# EAGLE design power electronicsV4.1 (EAGLE 9.6.2)

## Sheet 1 of 3
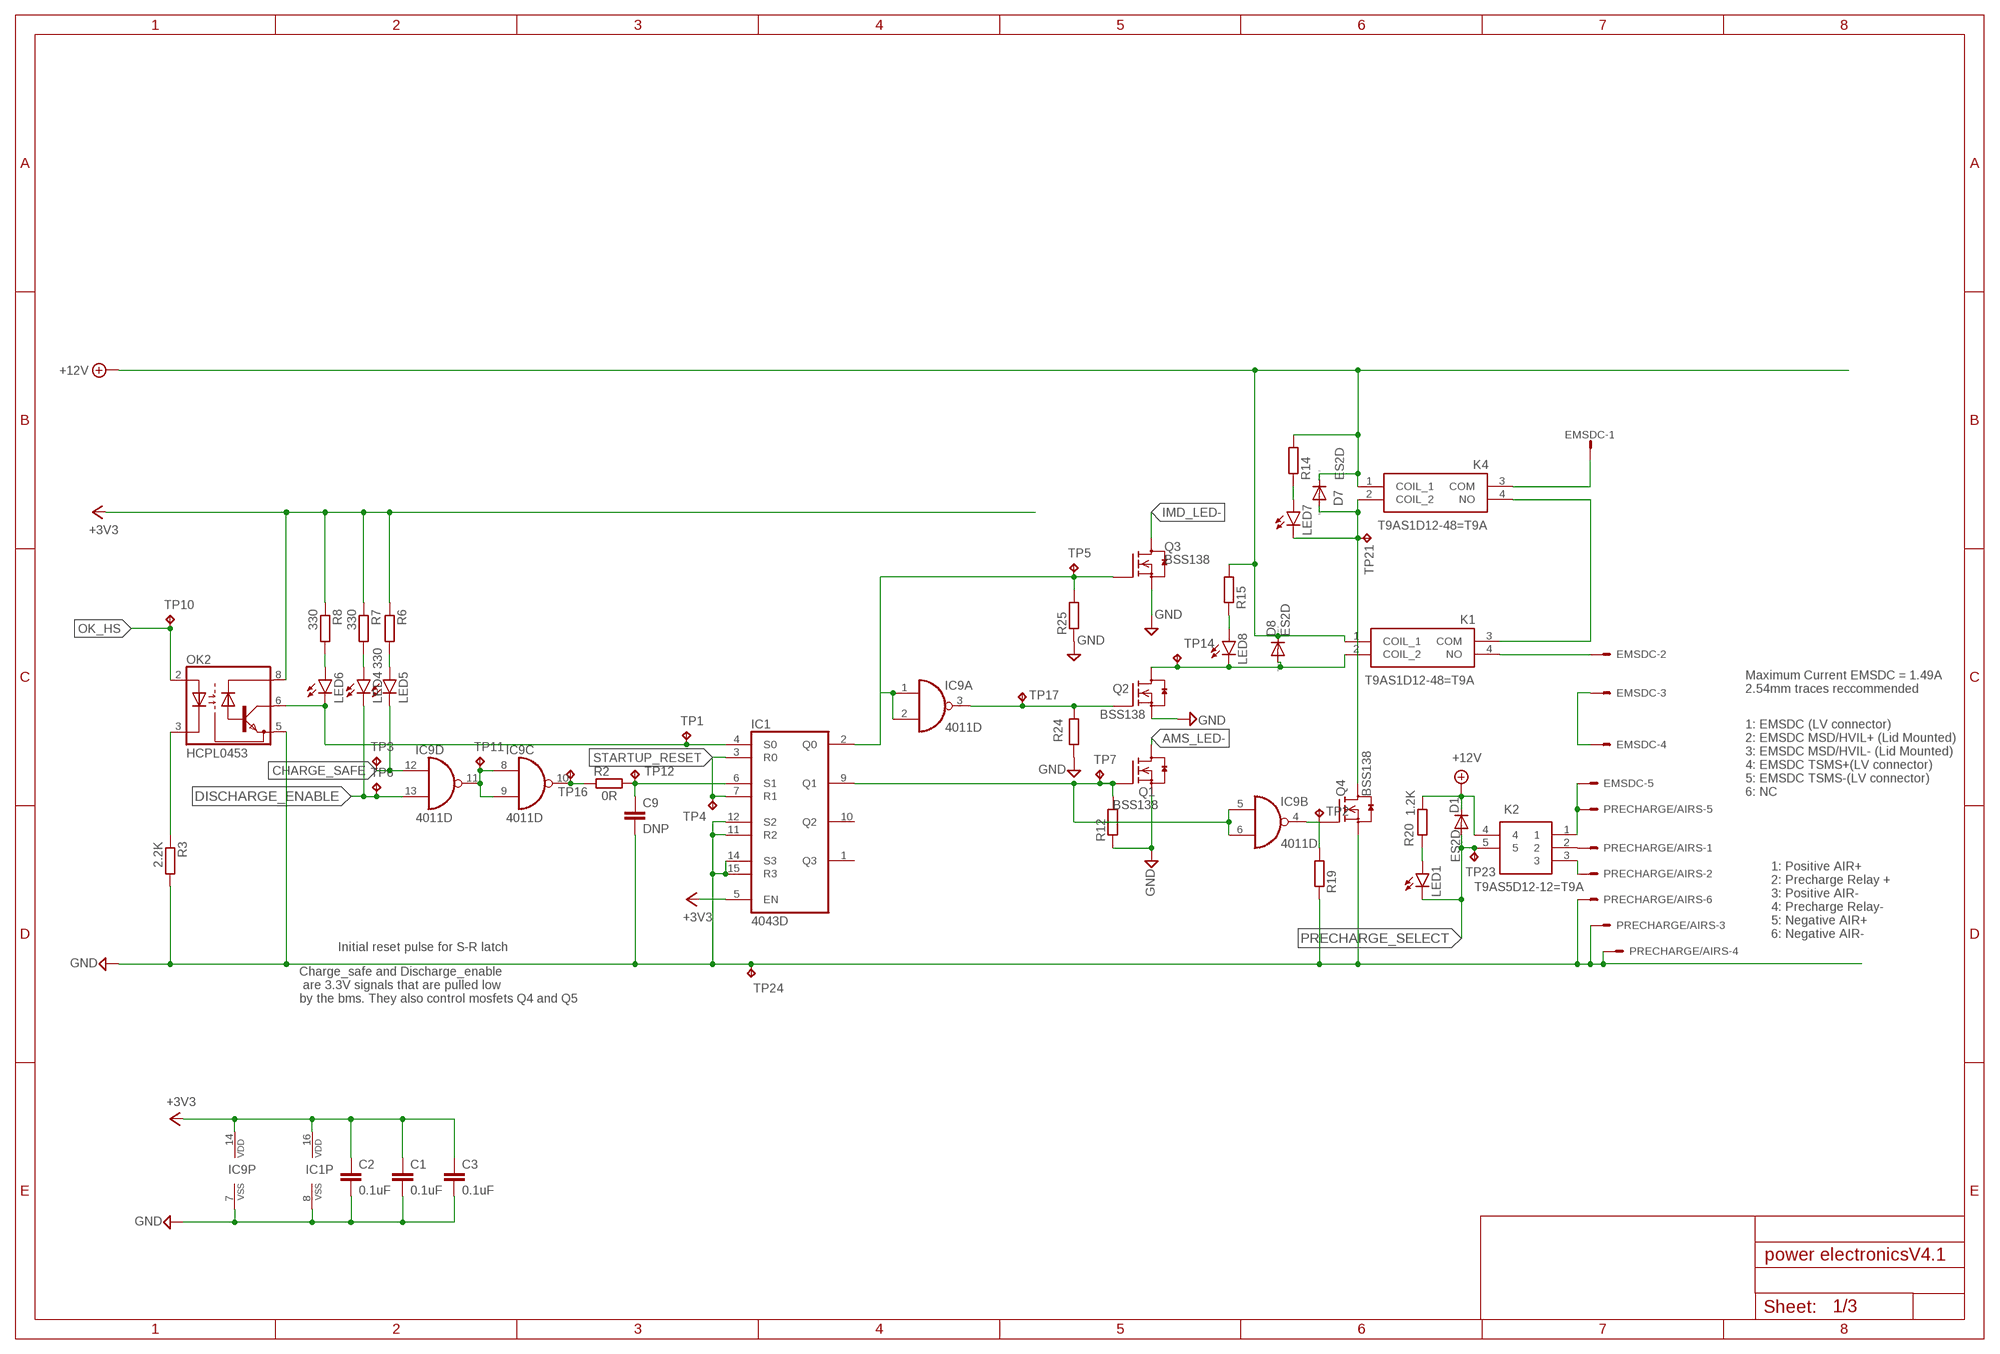
[diagram p0: schematic, sheet 1]

### Parts
C1  0.1uF  C-EUC0805  [C0805]
C2  0.1uF  C-EUC0805  [C0805]
C3  0.1uF  C-EUC0805  [C0805]
C9  DNP  C-EUC0805K  [C0805K]
D1  ES2D  [SMB]
D7  ES2D  [SMB]
D8  ES2D  [SMB]
EMSDC  KK-156-6  [KK-156-6]
IC1  4043D  [SO16]
IC9  4011D  [SO14]
K1  T9AS1D12-48=T9A  [T9AS1D1248T9A]
K2  T9AS5D12-12=T9A  [T9AS1D12]
K4  T9AS1D12-48=T9A  [T9AS1D1248T9A]
LED1  LEDSML0805  [SML0805]
LED4  LEDSML0805  [SML0805]
LED5  LEDSML0805  [SML0805]
LED6  LEDSML0805  [SML0805]
LED7  LEDSML0805  [SML0805]
LED8  LEDSML0805  [SML0805]
OK2  HCPL0453  [SOIC08]
PRECHARGE/AIRS  KK-156-6  [KK-156-6]
Q1  BSS138  [SOT23]
Q2  BSS138  [SOT23]
Q3  BSS138  [SOT23]
Q4  BSS138  [SOT23]
R2  0R  R-EU_R0805  [R0805]
R3  2.2K  R-EU_R0805  [R0805]
R6  330  R-EU_R0805  [R0805]
R7  330  R-EU_R0805  [R0805]
R8  330  R-EU_R0805  [R0805]
R12  R-EU_R0805  [R0805]
R14  R-EU_R0805  [R0805]
R15  R-EU_R0805  [R0805]
R19  R-EU_R0805  [R0805]
R20  1.2K  R-EU_R0805  [R0805]
R24  R-EU_R0805  [R0805]
R25  R-EU_R0805  [R0805]
TP1  TPPAD1-17  [P1-17]
TP2  TPPAD1-17  [P1-17]
TP3  TPPAD1-17  [P1-17]
TP4  TPPAD1-17  [P1-17]
TP5  TPPAD1-17  [P1-17]
TP6  TPPAD1-17  [P1-17]
TP7  TPPAD1-17  [P1-17]
TP10  TPPAD1-17  [P1-17]
TP11  TPPAD1-17  [P1-17]
TP12  TPPAD1-17  [P1-17]
TP14  TPPAD1-17  [P1-17]
TP16  TPPAD1-17  [P1-17]
TP17  TPPAD1-17  [P1-17]
TP21  TPPAD1-17  [P1-17]
TP23  TPPAD1-17  [P1-17]
TP24  TPPAD1-17  [P1-17]

### Nets
+3V3: C1.1 C2.1 C3.1 IC1.5(EN) IC1.16(VDD) IC9.14(P:VDD) OK2.8(VCC) R6.1 R7.1 R8.1 ; also sheet 2
+12V [power]: D1.C D7.C D8.C K1.1(COIL_1) K2.4 K4.1(COIL_1) R14.2 R15.2 R20.1 ; also sheet 2,3
AMS_LED-: Q1.3(D) ; also sheet 3
CHARGE_SAFE: IC9.12(D:I0) LED5.C TP3.TP ; also sheet 3
DISCHARGE_ENABLE: IC1.9(Q1) IC9.5(B:I0) IC9.6(B:I1) IC9.13(D:I1) LED4.C Q1.1(G) R12.2 TP6.TP TP7.TP ; also sheet 3
GND [GND]: C1.2 C2.2 C3.2 C9.2 IC1.8(VSS) IC1.11(R2) IC1.12(S2) IC1.14(S3) IC1.15(R3) IC9.7(P:VSS) OK2.5(GND) PRECHARGE/AIRS.3 PRECHARGE/AIRS.4 PRECHARGE/AIRS.6 Q1.2(S) Q2.2(S) Q3.2(S) Q4.2(S) R3.2 R12.1 R19.1 R24.1 R25.1 TP24.TP ; also sheet 2,3
IMD_COIL_OUT: D8.A K1.2(COIL_2) LED8.C Q2.3(D) TP14.TP
IMD_LED-: Q3.3(D) ; also sheet 3
N$1: IC9.10(C:O) R2.1 TP16.TP
N$3 [EMSDC]: K2.2 PRECHARGE/AIRS.1
N$5: IC1.4(S0) LED6.C OK2.6(VO) TP1.TP
N$6: IC9.8(C:I0) IC9.9(C:I1) IC9.11(D:O) TP11.TP
N$7: OK2.3(C) R3.1
N$8: IC9.3(A:O) Q2.1(G) R24.2 TP17.TP
N$9: IC1.2(Q0) IC9.1(A:I0) IC9.2(A:I1) Q3.1(G) R25.2 TP5.TP
N$10: C9.1 IC1.6(S1) R2.2 TP12.TP
N$11 [EMSDC]: EMSDC.5 K2.1 PRECHARGE/AIRS.5
N$12 [EMSDC]: K2.3 PRECHARGE/AIRS.2
N$13 [power]: EMSDC.1 K4.3(COM)
N$14: EMSDC.2 K1.4(NO)
N$15 [GND]: D7.A K4.2(COIL_2) LED7.C Q4.3(D) TP21.TP
N$16: IC9.4(B:O) Q4.1(G) R19.2 TP2.TP
N$18: LED7.A R14.1
N$19 [EMSDC]: EMSDC.3 EMSDC.4
N$20: LED8.A R15.1
N$21 [GND]: K1.3(COM) K4.4(NO)
N$22: LED1.A R20.2
N$25: LED4.A R7.2
N$26: LED5.A R6.2
N$27: LED6.A R8.2
OK_HS: OK2.2(A) TP10.TP ; also sheet 3
PRECHARGE_SELECT: D1.A K2.5 LED1.C TP23.TP ; also sheet 3
STARTUP_RESET: IC1.3(R0) IC1.7(R1) TP4.TP ; also sheet 2
Unconnected: EMSDC.6 IC1.1(Q3) IC1.10(Q2)

### Notes on the sheet
- Maximum Current EMSDC = 1.49A
  2.54mm traces reccommended
- 1: EMSDC (LV connector)
  2: EMSDC MSD/HVIL+ (Lid Mounted)
  3: EMSDC MSD/HVIL- (Lid Mounted)
  4: EMSDC TSMS+(LV connector)
  5: EMSDC TSMS-(LV connector)
  6: NC
- 1: Positive AIR+
  2: Precharge Relay +
  3: Positive AIR-
  4: Precharge Relay-
  5: Negative AIR+
  6: Negative AIR-
- Initial reset pulse for S-R latch
- Charge_safe and Discharge_enable
   are 3.3V signals that are pulled low 
  by the bms. They also control mosfets Q4 and Q5

## Sheet 2 of 3
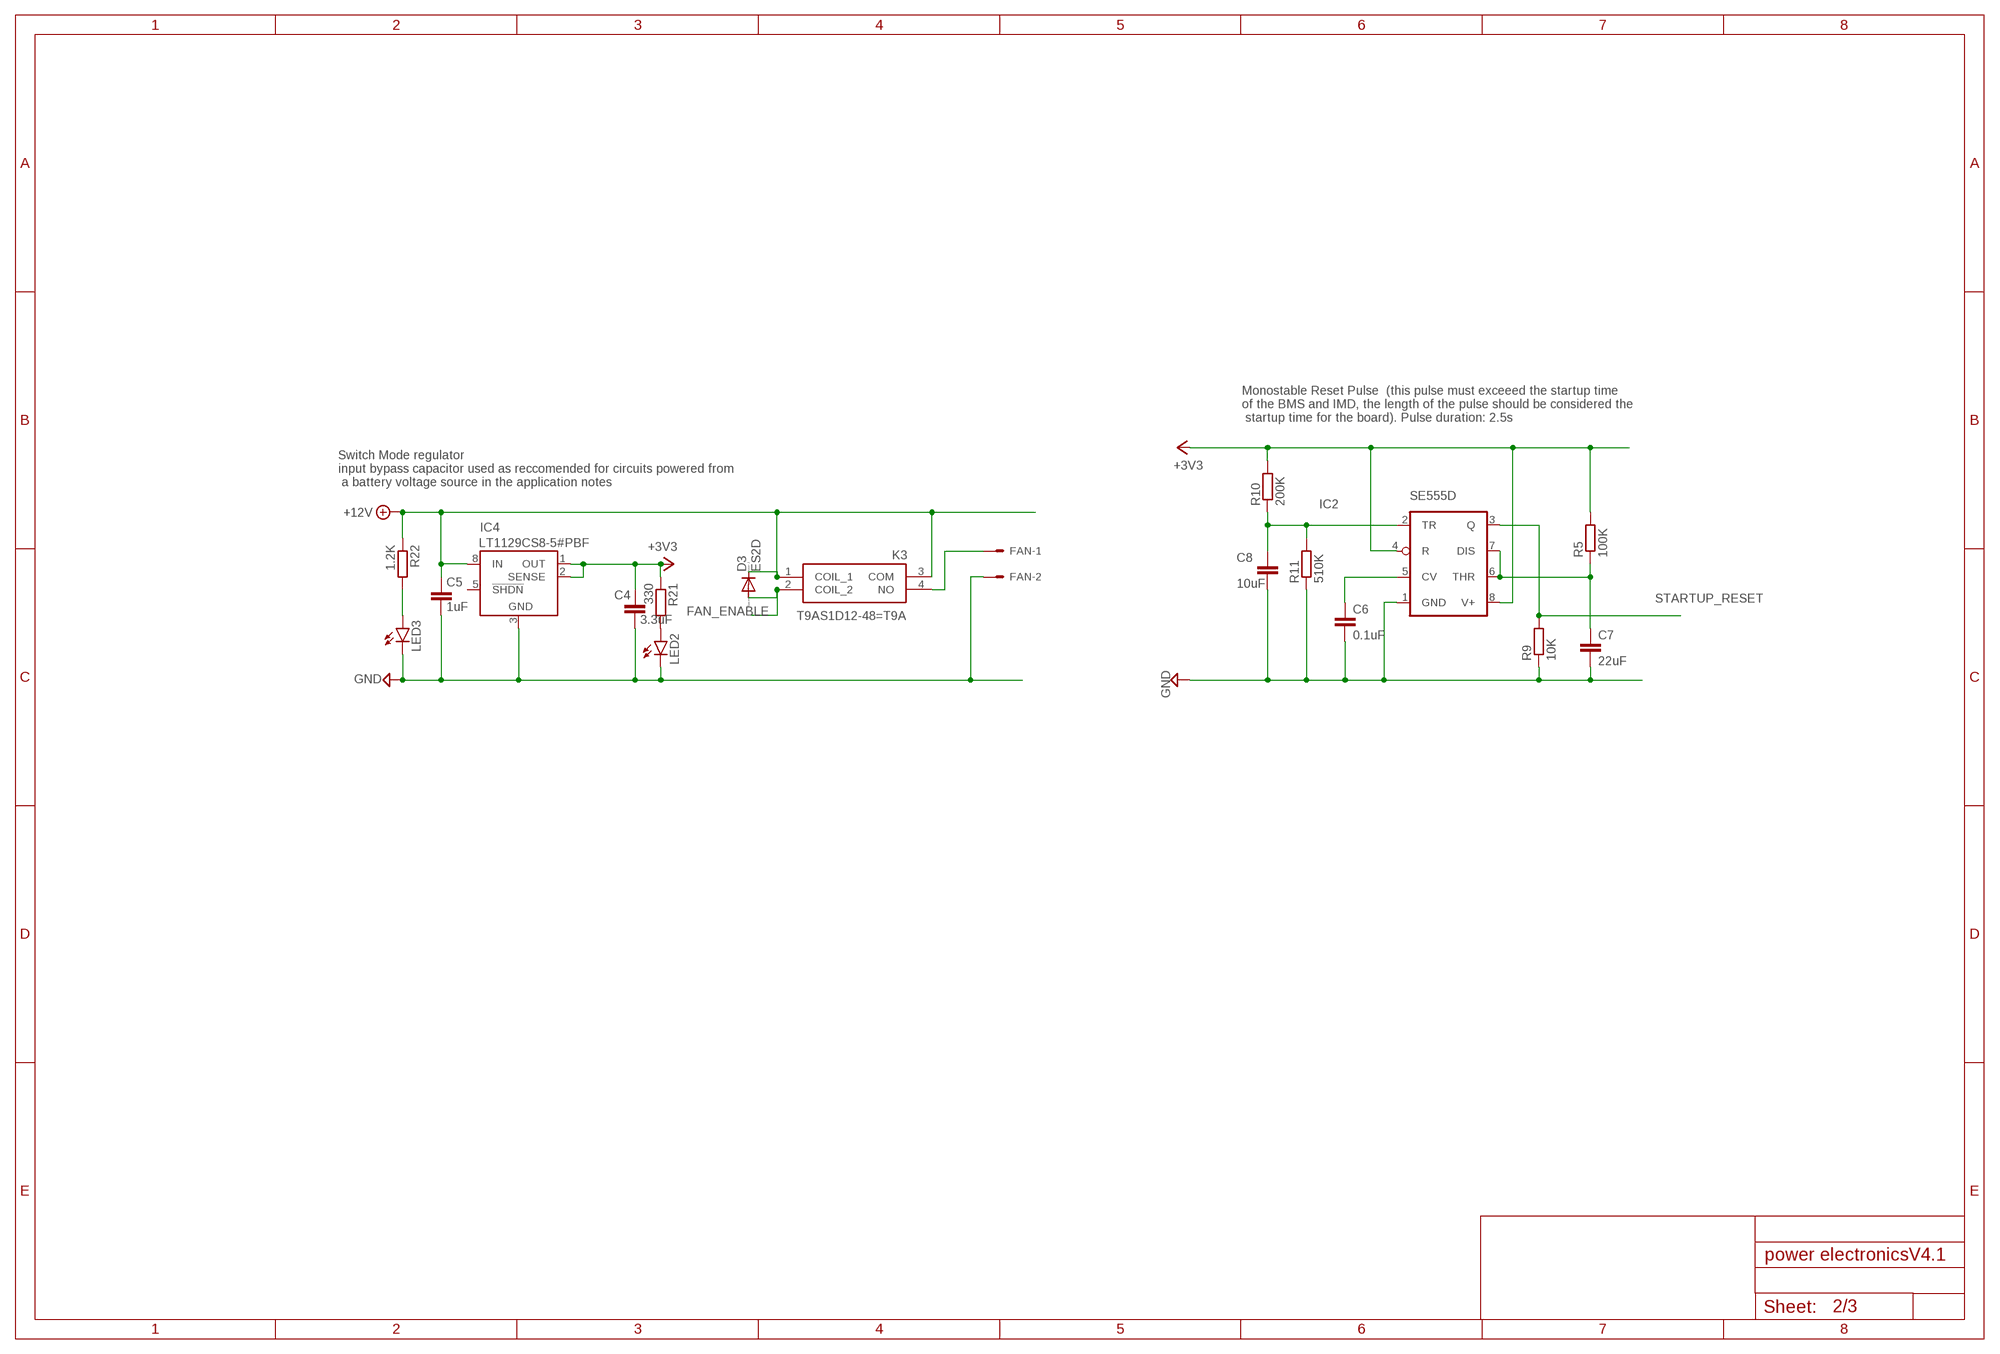
[diagram p1: schematic, sheet 2]

### Parts
C4  3.3uF  C-EUC0805  [C0805]
C5  1uF  C-EUC0805  [C0805]
C6  0.1uF  C-EUC0805  [C0805]
C7  22uF  C-EUC1206  [C1206]
C8  10uF  C-EUC0805  [C0805]
D3  ES2D  [SMB]
FAN  KK-156-2  [KK-156-2]
IC2  SE555D  [SO08]
IC4  LT1129CS8  [SOIC8]
K3  T9AS1D12-48=T9A  [T9AS1D1248T9A]
LED2  LEDSML0805  [SML0805]
LED3  LEDSML0805  [SML0805]
R5  100K  R-EU_R0805  [R0805]
R9  10K  R-EU_R0805  [R0805]
R10  200K  R-EU_R0805  [R0805]
R11  510K  R-EU_R0805  [R0805]
R21  330  R-EU_R0805  [R0805]
R22  1.2K  R-EU_R0805  [R0805]

### Nets
+3V3: C4.1 IC2.4(R) IC2.8(V+) IC4.1(OUT) IC4.2(SENSE) R5.2 R10.2 R21.1 ; also sheet 1
+12V [power]: C5.1 D3.C IC4.8(IN) K3.1(COIL_1) K3.3(COM) R22.1 ; also sheet 1,3
FAN+ [power]: FAN.1 K3.4(NO)
FAN_ENABLE: D3.A K3.2(COIL_2) ; also sheet 3
GND [GND]: C4.2 C5.2 C6.2 C7.2 C8.2 FAN.2 IC2.1(GND) IC4.3(GND) LED2.C LED3.C R9.1 R11.1 ; also sheet 1,3
N$17: C7.1 IC2.6(THR) IC2.7(DIS) R5.1
N$23: LED2.A R21.2
N$24: LED3.A R22.2
N$28: C8.1 IC2.2(TR) R10.1 R11.2
N$32: C6.1 IC2.5(CV)
STARTUP_RESET: IC2.3(Q) R9.2 ; also sheet 1
Unconnected: IC4.4(NC) IC4.5(!SHDN)

### Notes on the sheet
- Monostable Reset Pulse  (this pulse must exceeed the startup time 
  of the BMS and IMD, the length of the pulse should be considered the
   startup time for the board). Pulse duration: 2.5s
- Switch Mode regulator
  input bypass capacitor used as reccomended for circuits powered from
   a battery voltage source in the application notes

## Sheet 3 of 3
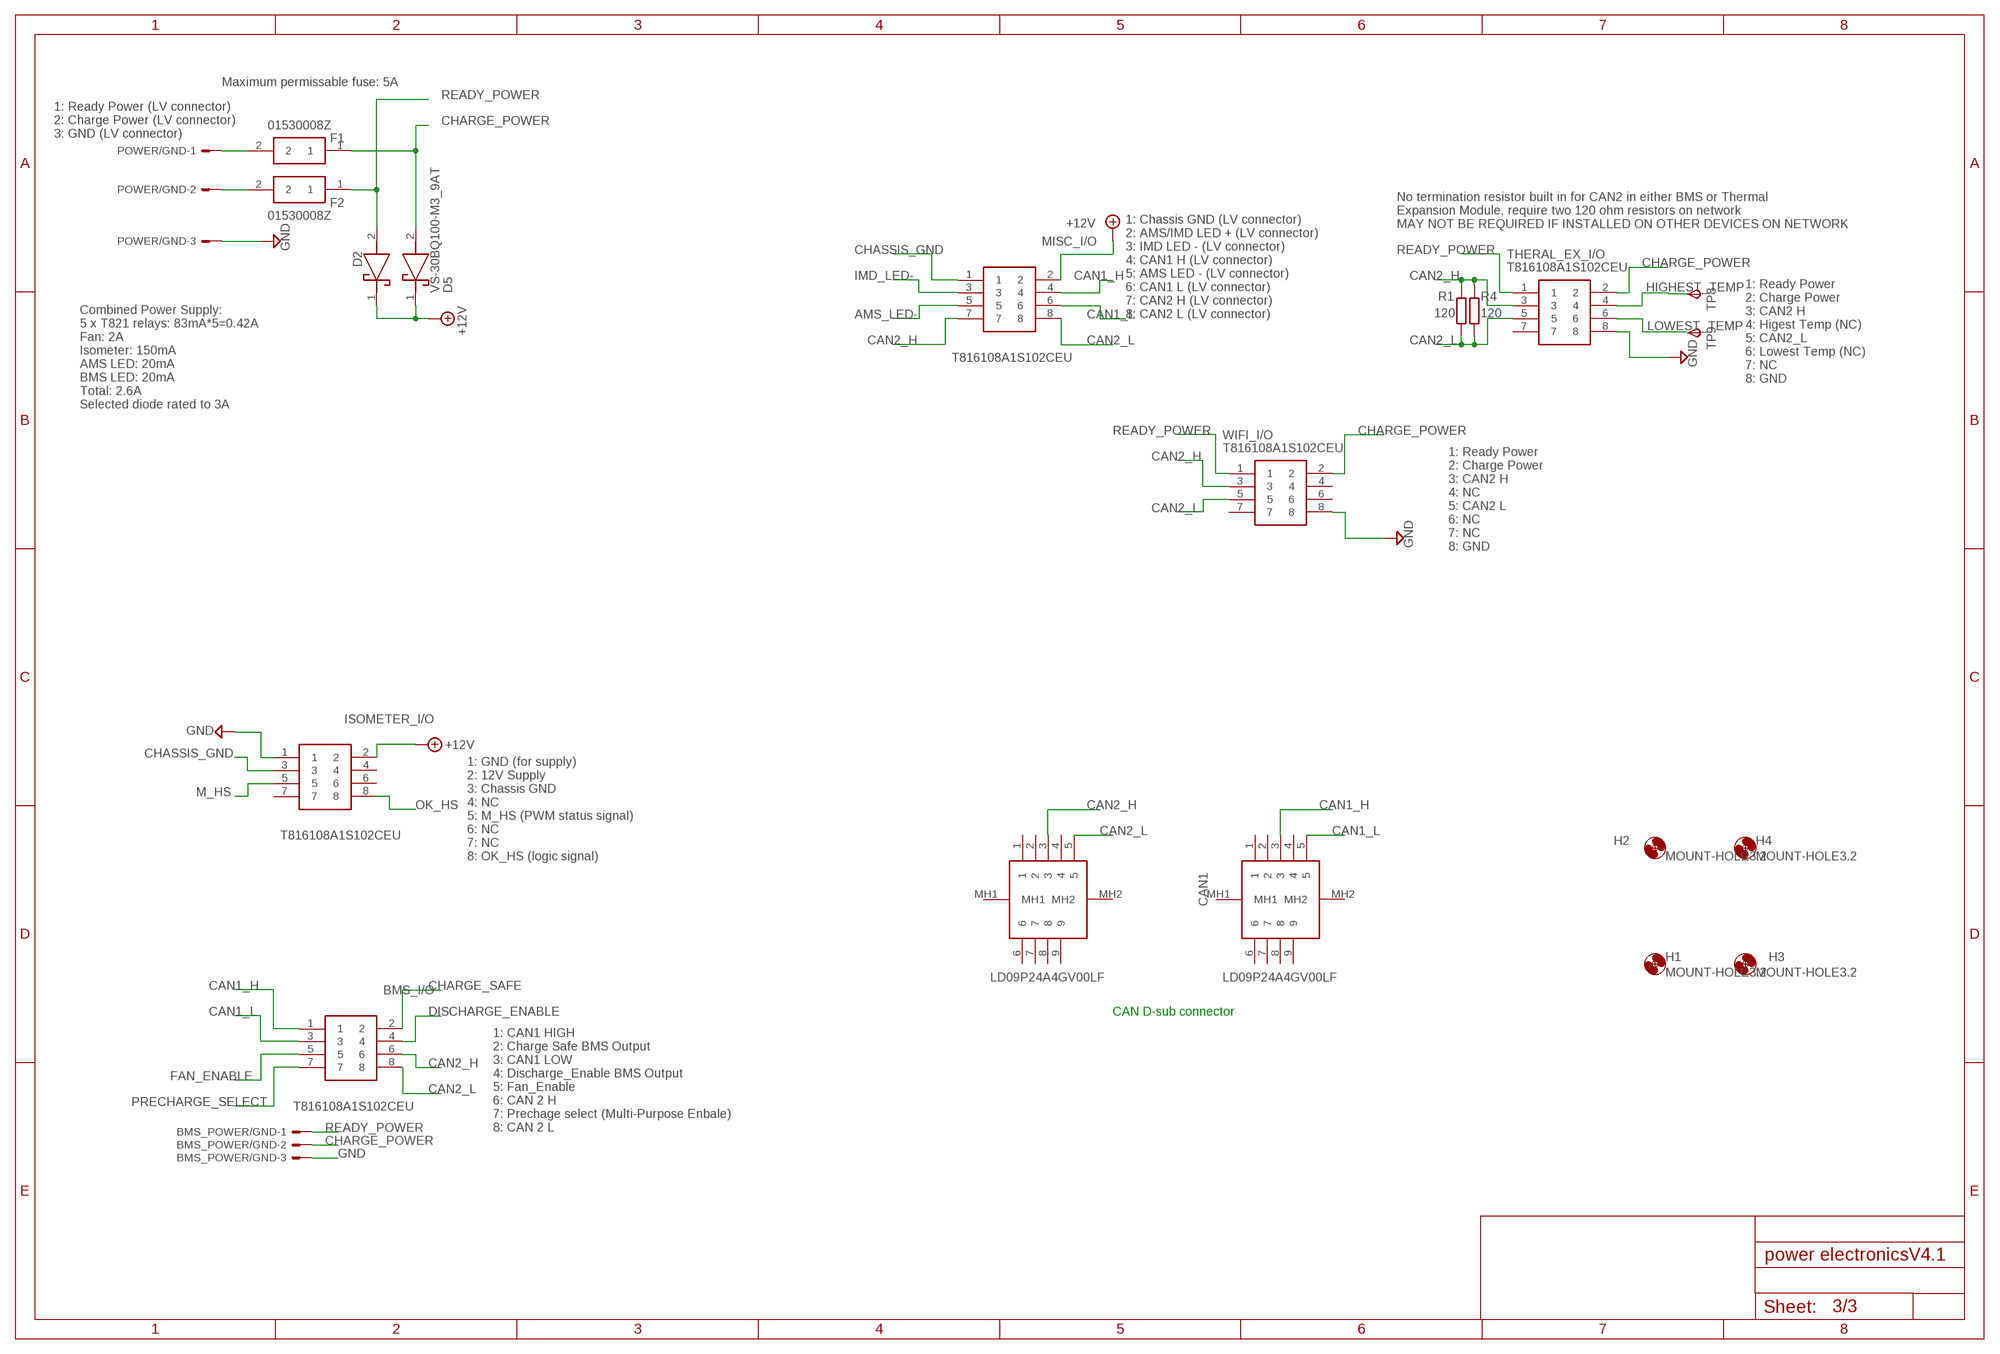
[diagram p2: schematic, sheet 3]

### Parts
BMS_I/O  T816108A1S102CEU  [T816108A1S102CEU]
BMS_POWER/GND  KK-156-3  [KK-156-3]
CAN1  LD09P24A4GV00LF  [LD09P24A4GV00LF]
CAN2  LD09P24A4GV00LF  [LD09P24A4GV00LF]
D2  VS-30BQ100-M3_9AT  [DIOM7959X262N]
D5  VS-30BQ100-M3_9AT  [DIOM7959X262N]
F1  01530008Z  [01530008]
F2  01530008Z  [01530008]
H1  MOUNT-HOLE3.2  [3,2]
H2  MOUNT-HOLE3.2  [3,2]
H3  MOUNT-HOLE3.2  [3,2]
H4  MOUNT-HOLE3.2  [3,2]
ISOMETER_I/O  T816108A1S102CEU  [T816108A1S102CEU]
MISC_I/O  T816108A1S102CEU  [T816108A1S102CEU]
POWER/GND  KK-156-3  [KK-156-3]
R1  120  R-EU_R1206  [R1206]
R4  120  R-EU_R1206  [R1206]
THERAL_EX_I/O  T816108A1S102CEU  [T816108A1S102CEU]
TP8  TPSTP11R  [TP11R]
TP9  TPSTP11R  [TP11R]
WIFI_I/O  T816108A1S102CEU  [T816108A1S102CEU]

### Nets
+12V [power]: D2.1(K) D5.1(K) ISOMETER_I/O.2 MISC_I/O.2 ; also sheet 1,2
AMS_LED-: MISC_I/O.5 ; also sheet 1
CAN1_H: BMS_I/O.1 CAN1.3 MISC_I/O.4
CAN1_L: BMS_I/O.3 CAN1.5 MISC_I/O.6
CAN2_H: BMS_I/O.6 CAN2.3 MISC_I/O.7 R1.1 R4.1 THERAL_EX_I/O.3 WIFI_I/O.3
CAN2_L: BMS_I/O.8 CAN2.5 MISC_I/O.8 R1.2 R4.2 THERAL_EX_I/O.5 WIFI_I/O.5
CHARGE_POWER [power]: BMS_POWER/GND.2 D5.2(A) F1.1 THERAL_EX_I/O.2 WIFI_I/O.2
CHARGE_SAFE: BMS_I/O.2 ; also sheet 1
CHASSIS_GND [GND]: ISOMETER_I/O.3 MISC_I/O.1
DISCHARGE_ENABLE: BMS_I/O.4 ; also sheet 1
FAN_ENABLE: BMS_I/O.5 ; also sheet 2
GND [GND]: BMS_POWER/GND.3 ISOMETER_I/O.1 POWER/GND.3 THERAL_EX_I/O.8 WIFI_I/O.8 ; also sheet 1,2
HIGHEST_TEMP: THERAL_EX_I/O.4 TP8.TP(PP)
IMD_LED-: MISC_I/O.3 ; also sheet 1
LOWEST_TEMP: THERAL_EX_I/O.6 TP9.TP(PP)
M_HS: ISOMETER_I/O.5
N$2 [power]: F2.2 POWER/GND.2
N$4 [power]: F1.2 POWER/GND.1
OK_HS: ISOMETER_I/O.8 ; also sheet 1
PRECHARGE_SELECT: BMS_I/O.7 ; also sheet 1
READY_POWER [power]: BMS_POWER/GND.1 D2.2(A) F2.1 THERAL_EX_I/O.1 WIFI_I/O.1
Unconnected: CAN1.1 CAN1.2 CAN1.4 CAN1.6 CAN1.7 CAN1.8 CAN1.9 CAN1.MH1 CAN1.MH2 CAN2.1 CAN2.2 CAN2.4 CAN2.6 CAN2.7 CAN2.8 CAN2.9 CAN2.MH1 CAN2.MH2 ISOMETER_I/O.4 ISOMETER_I/O.6 ISOMETER_I/O.7 THERAL_EX_I/O.7 WIFI_I/O.4 WIFI_I/O.6 WIFI_I/O.7

### Notes on the sheet
- Maximum permissable fuse: 5A
- 1: Ready Power (LV connector)
  2: Charge Power (LV connector)
  3: GND (LV connector)
- No termination resistor built in for CAN2 in either BMS or Thermal
  Expansion Module, require two 120 ohm resistors on network
  MAY NOT BE REQUIRED IF INSTALLED ON OTHER DEVICES ON NETWORK
- 1: Chassis GND (LV connector)
  2: AMS/IMD LED + (LV connector)
  3: IMD LED - (LV connector)
  4: CAN1 H (LV connector)
  5: AMS LED - (LV connector)
  6: CAN1 L (LV connector)
  7: CAN2 H (LV connector)
  8: CAN2 L (LV connector)
- 1: Ready Power
  2: Charge Power
  3: CAN2 H
  4: Higest Temp (NC)
  5: CAN2_L
  6: Lowest Temp (NC)
  7: NC
  8: GND
- Combined Power Supply:
  5 x T821 relays: 83mA*5=0.42A
  Fan: 2A
  Isometer: 150mA
  AMS LED: 20mA
  BMS LED: 20mA
  Total: 2.6A
  Selected diode rated to 3A
- 1: Ready Power
  2: Charge Power
  3: CAN2 H
  4: NC
  5: CAN2 L
  6: NC
  7: NC
  8: GND
- 1: GND (for supply) 
  2: 12V Supply
  3: Chassis GND 
  4: NC 
  5: M_HS (PWM status signal)
  6: NC
  7: NC
  8: OK_HS (logic signal)
- CAN D-sub connector
- 1: CAN1 HIGH
  2: Charge Safe BMS Output 
  3: CAN1 LOW
  4: Discharge_Enable BMS Output
  5: Fan_Enable
  6: CAN 2 H
  7: Prechage select (Multi-Purpose Enbale)
  8: CAN 2 L

## Power pins joined to a net without a drawn wire
GND: IC4.6(GND) IC4.7(GND)

## Library data of the parts
BMS_I/O ISOMETER_I/O MISC_I/O THERAL_EX_I/O WIFI_I/O = T816108A1S102CEU:T816108A1S102CEU: Amphenol T816 Series, 2.54mm Pitch 8 Way 2 Row Straight PCB Header, Solder Termination, 3A Source: Datasheet <https://docs.rs-online.com/fce6/0900766b81359cbb.pdf>; DESCRIPTION: Amphenol T816 Series, 2.54mm Pitch 8 Way 2 Row Straight PCB Header, Solder Termination, 3A; HEIGHT: 27.2mm; MANUFACTURER_NAME: Amphenol; MANUFACTURER_PART_NUMBER: T816108A1S102CEU
BMS_POWER/GND POWER/GND = con-molex:KK-156-3: KK 156 HEADER Source: http://www.molex.com/pdm_docs/sd/026604100_sd.pdf; MF: MOLEX; OC_FARNELL: unknown; OC_NEWARK: unknown
C1-C9 = rcl:C-EU: CAPACITOR, European symbol; SPICEPREFIX: C
CAN1 CAN2 = LD09P24A4GV00LF:LD09P24A4GV00LF: Amphenol FCI LD Series, 9 Way Plug-In Mount D-sub Connector Plug, 2.74mm Pitch, with Screw Source: Datasheet <https://www.mouser.com/datasheet/2/18/10130912-1362365.pdf>; ARROW_PART_NUMBER: LD09P24A4GV00LF; ARROW_PRICE-STOCK: https://www.arrow.com/en/products/ld09p24a4gv00lf/amphenol-fci?region=nac; DESCRIPTION: Amphenol FCI LD Series, 9 Way Plug-In Mount D-sub Connector Plug, 2.74mm Pitch, with Screw; HEIGHT: 12.15mm; MANUFACTURER_NAME: Amphenol Communication Solutions; MANUFACTURER_PART_NUMBER: LD09P24A4GV00LF; MOUSER_PART_NUMBER: 649-LD09P24A4GV00LF; MOUSER_PRICE-STOCK: https://www.mouser.co.uk/ProductDetail/Amphenol-FCI/LD09P24A4GV00LF?qs=tZOhSuJQg1nfkziarphghA%3D%3D
D1 D3 D7 D8 = diode:ES2D: DIODE super fast rectifier, 2 A
D2 D5 = SamacSys_Parts:VS-30BQ100-M3_9AT: Vishay VS-30BQ100-M3/9AT SMT Schottky Diode, 100V 3A, 2-Pin DO-214AB Source: Datasheet <https://componentsearchengine.com/Datasheets/1/VS-30BQ100-M3_9AT.pdf>; DESCRIPTION: Vishay VS-30BQ100-M3/9AT SMT Schottky Diode, 100V 3A, 2-Pin DO-214AB; HEIGHT: 2.62mm; MANUFACTURER_NAME: Vishay; MANUFACTURER_PART_NUMBER: VS-30BQ100-M3/9AT; MOUSER_PART_NUMBER: 78-VS-30BQ100-M39AT; MOUSER_PRICE-STOCK: https://www.mouser.com/Search/Refine.aspx?Keyword=78-VS-30BQ100-M39AT
EMSDC PRECHARGE/AIRS = con-molex:KK-156-6: KK 156 HEADER Source: http://www.molex.com/pdm_docs/sd/026604100_sd.pdf; MF: MOLEX; OC_FARNELL: unknown; OC_NEWARK: unknown
F1 F2 = SamacSys_Parts:01530008Z: Mini fuseholder,15A 32V Littelfuse 15A PCB Mount Fuse Holder Automotive Fuse, 32 V Source: Datasheet <http://www.littelfuse.com/data/en/data_sheets/153_pcmount.pdf>; ALLIED_NUMBER: 70184304; DESCRIPTION: Mini fuseholder,15A 32V Littelfuse 15A PCB Mount Fuse Holder Automotive Fuse, 32 V; HEIGHT: mm; MANUFACTURER_NAME: LITTELFUSE; MANUFACTURER_PART_NUMBER: 01530008Z; RS_PART_NUMBER: 3607317; RS_PRICE-STOCK: https://uk.rs-online.com/web/p/products/3607317
FAN = con-molex:KK-156-2: KK 156 HEADER Source: http://www.molex.com/pdm_docs/sd/026604100_sd.pdf; MF: MOLEX; OC_FARNELL: unknown; OC_NEWARK: unknown
H1-H4 = holes:MOUNT-HOLE: MOUNTING HOLE with drill center marker
IC1 = 40xx:4043: Quad 3-state NOR R/S LATCH
IC2 = linear:*555: TIMER
IC4 = linear-technology:LT1129CS8: VOLTAGE REGULATOR with shutdown; MPN: LT1129CS8-5#PBF; OC_FARNELL: 1273576; OC_NEWARK: 57M2078
IC9 = 40xx:4011: Quad 2-input NAND
K1 K3 K4 = SamacSys_Parts:T9AS1D12-48=T9A: SPST-NO PCB Mount Non-Latching Relay Through Hole, 48V dc Source: Datasheet <http://uk.rs-online.com/web/p/products/6802534P>; DESCRIPTION: SPST-NO PCB Mount Non-Latching Relay Through Hole, 48V dc; HEIGHT: 20.4mm; MANUFACTURER_NAME: TE Connectivity; MANUFACTURER_PART_NUMBER: T9AS1D12-48=T9A; RS_PART_NUMBER: 6802534P; RS_PRICE-STOCK: http://uk.rs-online.com/web/p/products/6802534P
K2 = SamacSys_Parts:T9AS5D12-12=T9A: PCB Relay SPDT 30A 12Vdc,thru hole SPDT PCB Mount Non-Latching Relay Through Hole, 12V dc Source: Datasheet; ALLIED_NUMBER: R1111589; DESCRIPTION: PCB Relay SPDT 30A 12Vdc,thru hole SPDT PCB Mount Non-Latching Relay Through Hole, 12V dc; HEIGHT: mm; MANUFACTURER_NAME: TE Connectivity; MANUFACTURER_PART_NUMBER: T9AS5D12-12=T9A; RS_PART_NUMBER: 6802528; RS_PRICE-STOCK: https://uk.rs-online.com/web/p/products/6802528
LED1-LED8 = led:LED: LED OSRAM: - CHIPLED LG R971, LG N971, LY N971, LG Q971, LY Q971, LO R971, LY R971 LH N974, LH R974 LS Q976, LO Q976, LY Q976 LO Q996 - Hyper CHIPLED LW Q18S LB Q993, LB Q99A, LB R99A - SideLED LS A670, LO A670, LY A670, LG A670, LP A670 LB A673, LV A673, LT A673, LW A673 LH A674 LY A675 LS A676, LA A676, LO A676, LY A676, LW A676 LS A679, LY A679, LG A679 - Hyper Micro SIDELED® LS Y876, LA Y876, LO Y876, LY Y876 LT Y87S - SmartLED LW L88C, LW L88S LB L89C, LB L89S, LG L890 LS L89K, LO L89K, LY L89K LS L896, LA L896, LO L896, LY L896 - TOPLED LS T670, LO T670, LY T670, LG T670, LP T670 LSG T670, LSP T670, LSY T670, LOP T670, LYG T670 LG T671, LOG T671, LSG T671 LB T673, LV T673, LT T673, LW T673 LH T674 LS T676, LA T676, LO T676, LY T676, LB T676, LH T676, LSB T676, LW T676 LB T67C, LV T67C, LT T67C, LS T67K, LO T67K, LY T67K, LW E67C LS E67B, LA E67B, LO E67B, LY E67B, LB E67C, LV E67C, LT E67C LW T67C LS T679, LY T679, LG T679 LS T770, LO T770, LY T770, LG T770, LP T770 LB T773, LV T773, LT T773, LW T773 LH T774 LS E675, LA E675, LY E675, LS T675 LS T776, LA T776, LO T776, LY T776, LB T776 LHGB T686 LT T68C, LB T68C - Hyper Mini TOPLED® LB M676 - Mini TOPLED Santana® LG M470 LS M47K, LO M47K, LY M47K Source: http://www.osram.convergy.de LUXEON: - LUMILED® LXK2-PW12-R00, LXK2-PW12-S00, LXK2-PW14-U00, LXK2-PW14-V00 LXK2-PM12-R00, LXK2-PM12-S00, LXK2-PM14-U00 LXK2-PE12-Q00, LXK2-PE12-R00, LXK2-PE12-S00, LXK2-PE14-T00, LXK2-PE14-U00 LXK2-PB12-K00, LXK2-PB12-L00, LXK2-PB12-M00, LXK2-PB14-N00, LXK2-PB14-P00, LXK2-PB14-Q00 LXK2-PR12-L00, LXK2-PR12-M00, LXK2-PR14-Q00, LXK2-PR14-R00 LXK2-PD12-Q00, LXK2-PD12-R00, LXK2-PD12-S00 LXK2-PH12-R00, LXK2-PH12-S00 LXK2-PL12-P00, LXK2-PL12-Q00, LXK2-PL12-R00 Source: www.luxeon.com KINGBRIGHT: KA-3528ASYC Source: www.kingbright.com
OK2 = optocoupler:HCPL0453: HEWLETT PACKARD OPTO COUPLER; MF: AGILENT TECHNOLOGIES; MPN: HCPL-0453-000E; OC_FARNELL: 1505123; OC_NEWARK: 88H7766
Q1-Q4 = m-pad-2.1:BSS138: Fairchild Semiconductors BSS138 N-Channel Logic Level Enhancement Mode Field Effect Transistor General Description: These N-Channel enhancement mode field effect transistors are produced using Fairchild's proprietary, high cell density, DMOS technology. These products have been designed to minimize on-state resistance while provide rugged, reliable, and fast switching performance.These products are particularly suited for low voltage, low current applications such as small servo motor control, power MOSFET gate drivers, and other switching applications. Features: 0.22 A, 50 V. RDS(ON) = 3.5Ohm @ VGS = 10 V RDS(ON) = 6.0Ohm @ VGS = 4.5 V High density cell design for extremely low RDS(ON) Rugged and Reliable Compact industry standard SOT-23 surface mount package Please send any comments to: messi@users.sourceforge.net
R1-R12 R14 R15 R19-R22 R24 R25 = rcl:R-EU_: RESISTOR, European symbol; SPICEPREFIX: R
TP1-TP7 TP10-TP12 TP14 TP16 TP17 TP21 TP23 TP24 = testpad:TP: Test pad
TP8 TP9 = testpad:TPS: TEST PIN

## Net classes
0 default: width 0.508 mm
1 GND: width 0.889 mm
2 EMSDC: width 2.54 mm
3 power: width 0.889 mm

## Board
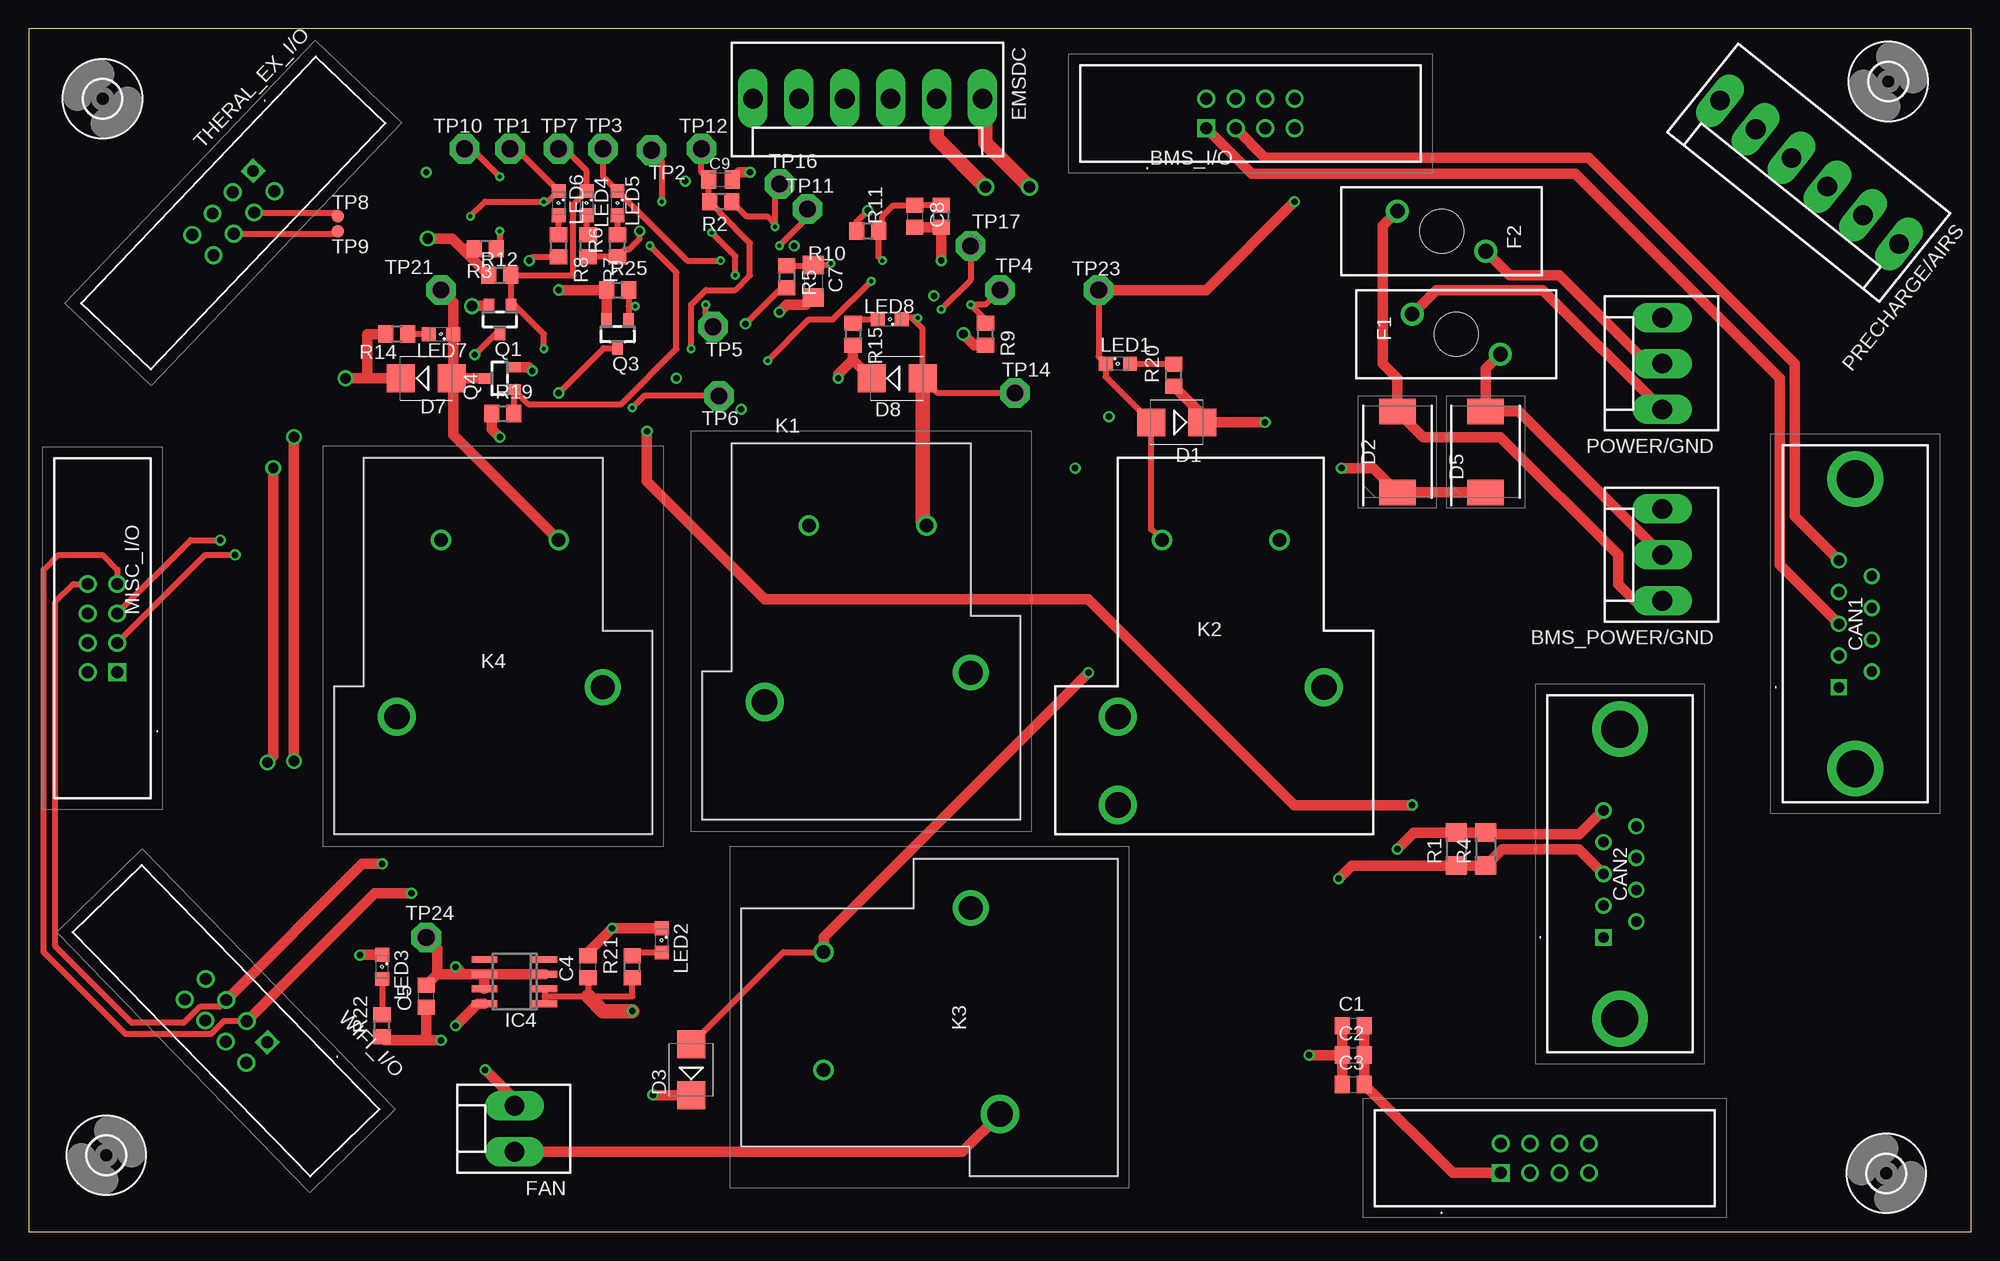
[diagram p3: board, top side]
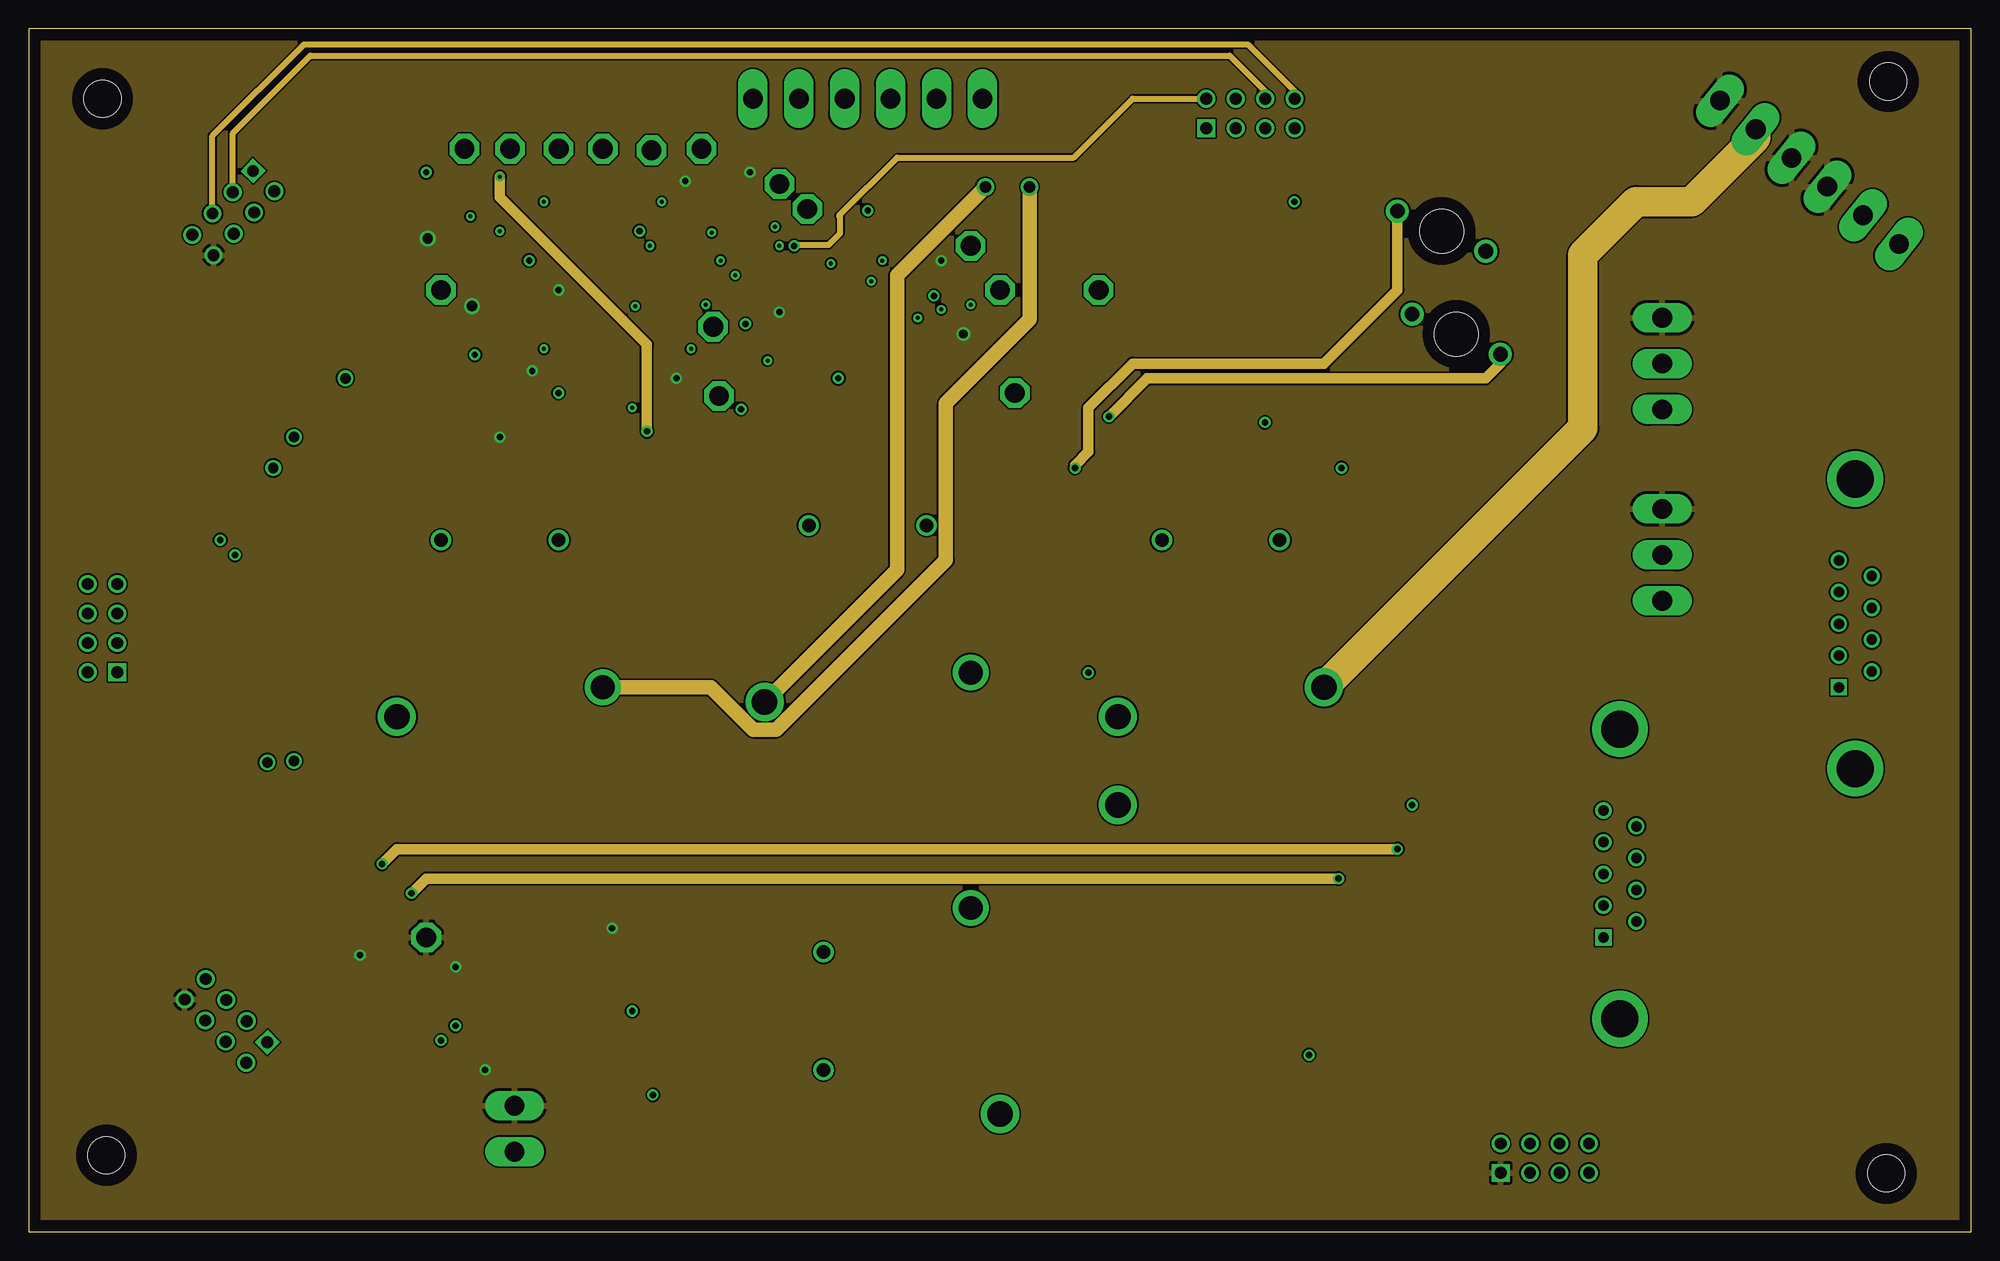
[diagram p4: board, inner layer Route2]
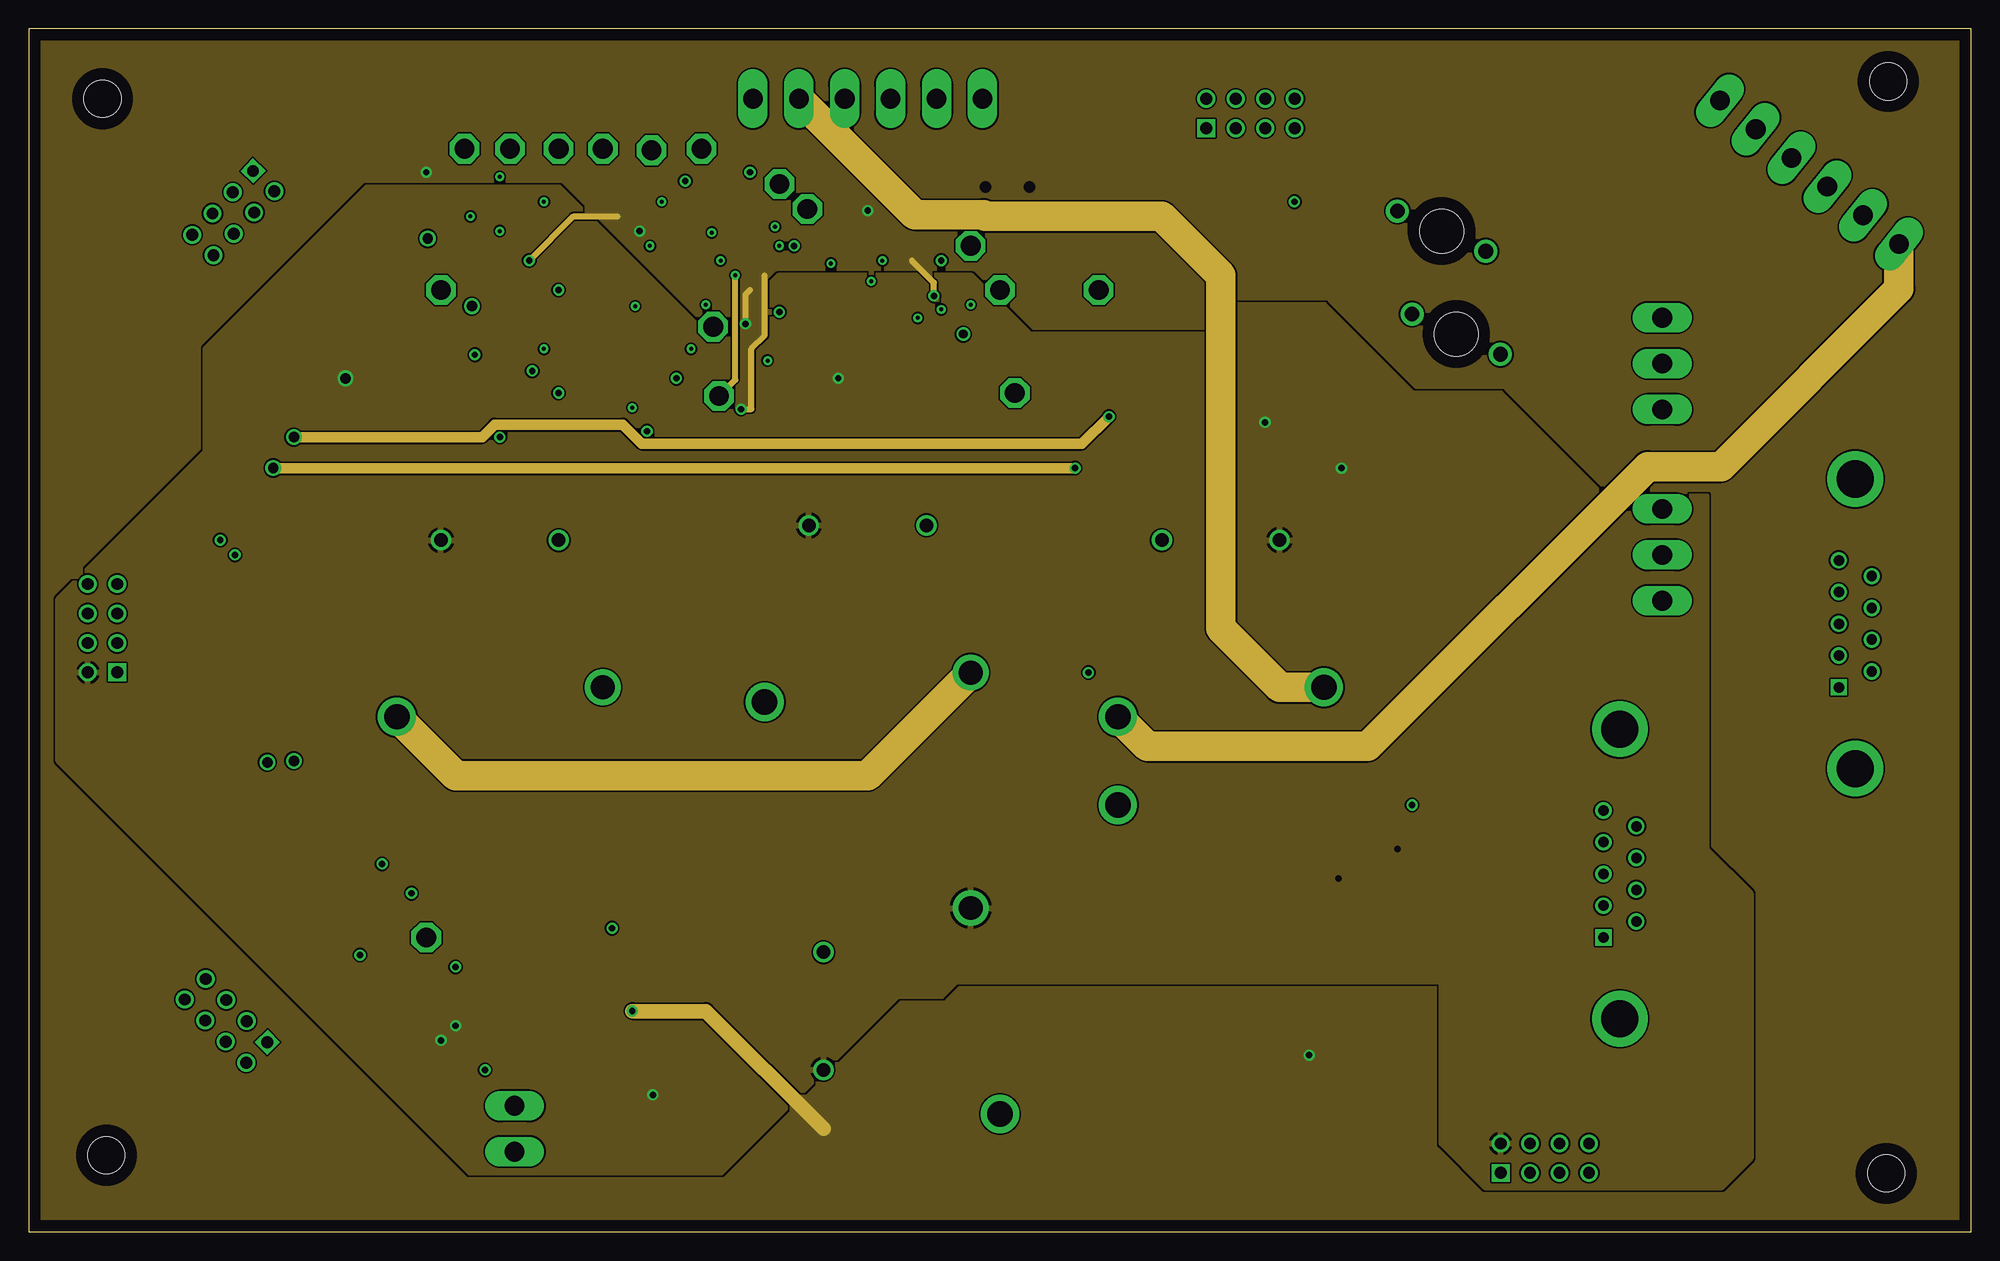
[diagram p5: board, inner layer Route15]
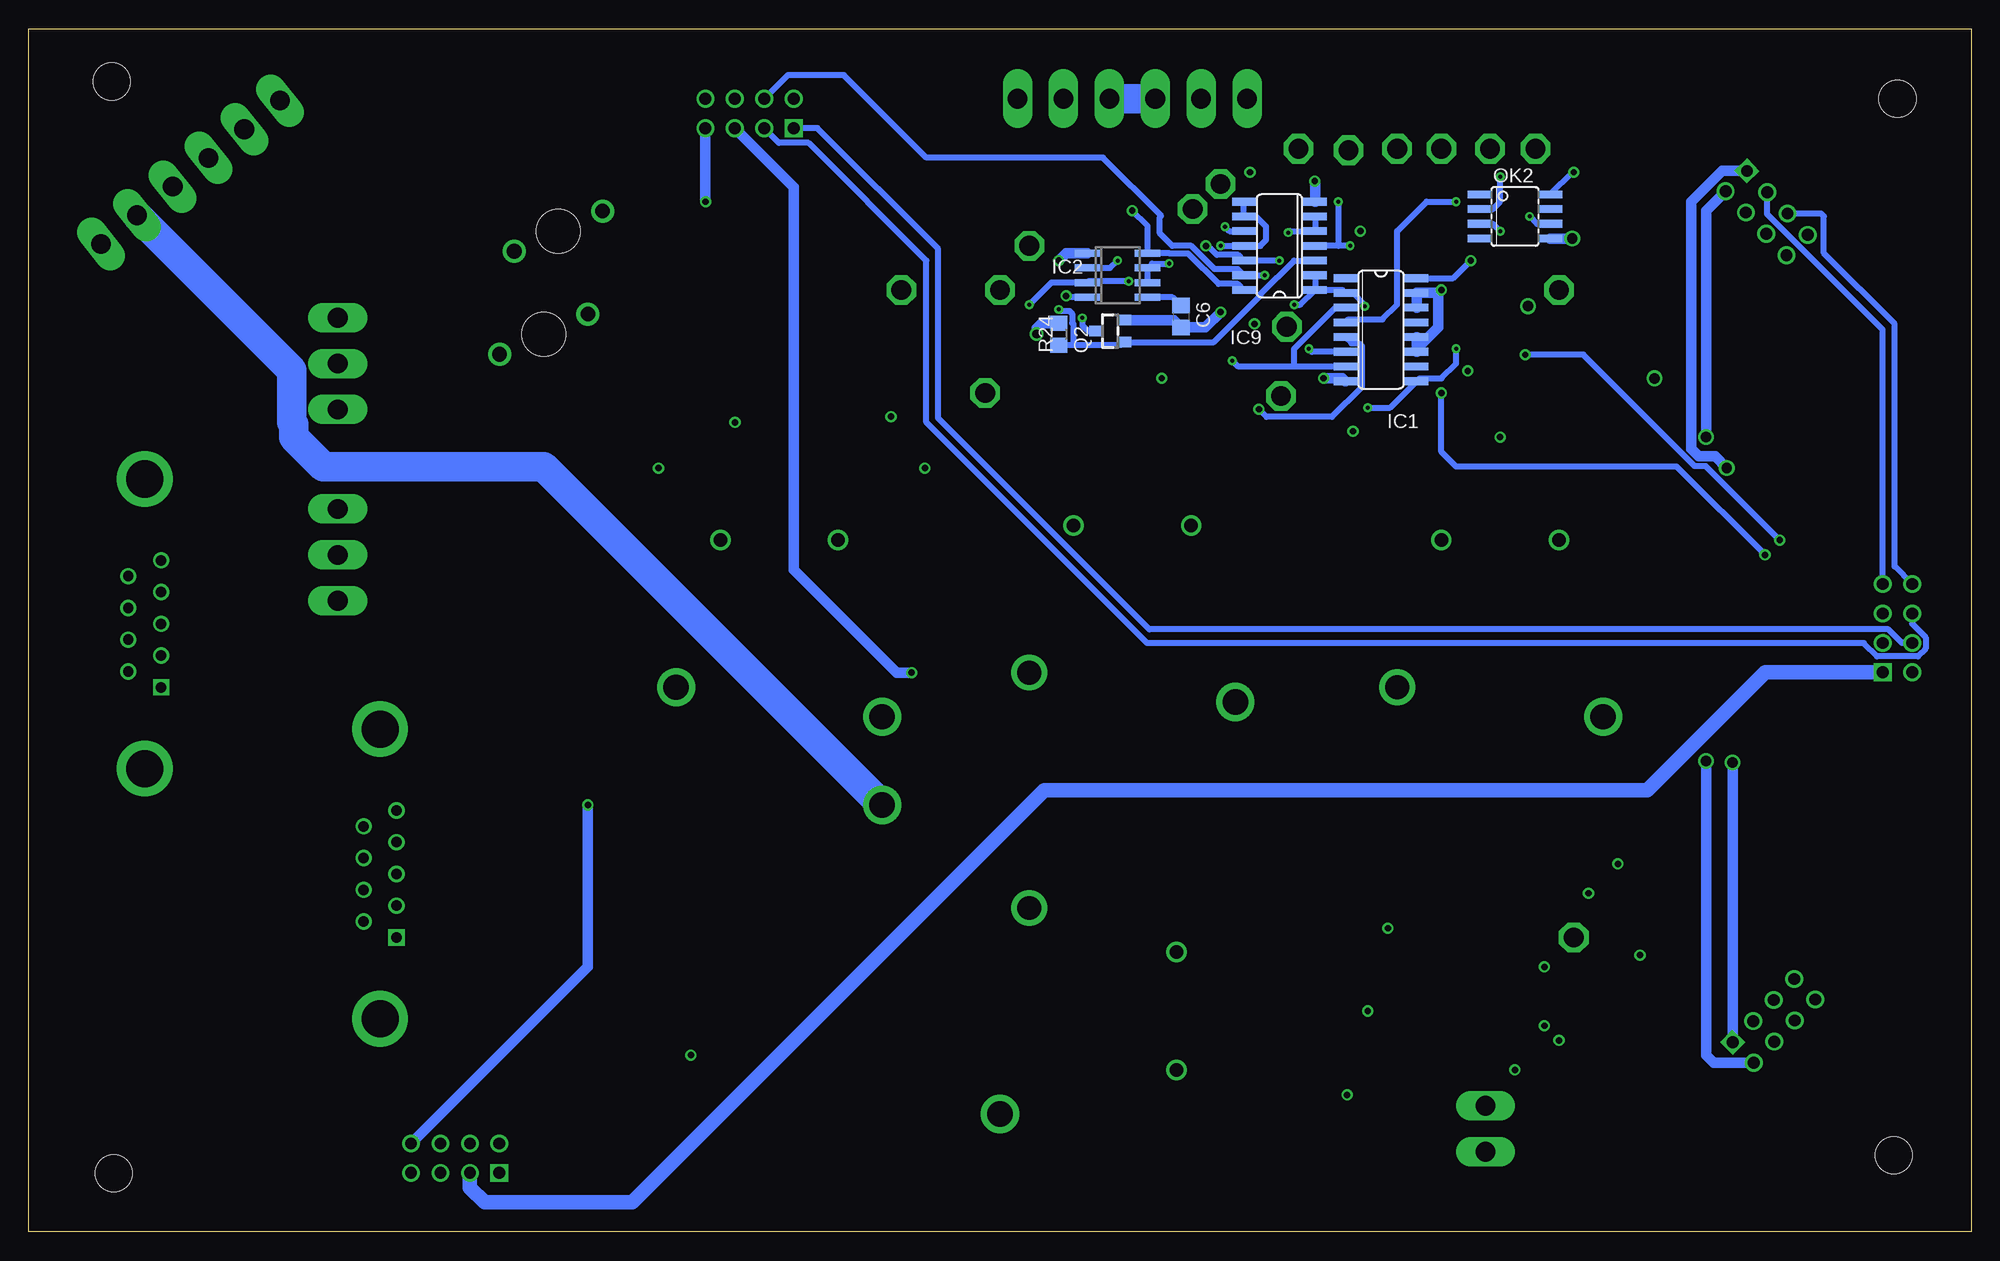
[diagram p6: board, bottom side, seen from below]

Size 167.62 x 103.81 mm. Coordinates in mm from the lower left corner, seen from the top.
Outline: 0,0 167.62,0 167.62,103.81 0,103.81 0,0
Copper layers ([2:[15:1+2*15+16]]): Top 0.035mm / dielectric 0.11mm / Route2 0.035mm / dielectric 1.2mm / Route15 0.035mm / dielectric 0.11mm / Bottom 0.035mm
Design rules "default *": minimum track width 6mil, minimum drill 0.35mm, track to track 6mil, track to pad 6mil, pad to pad 6mil, via to via 6mil, smd to smd 6mil, copper to edge 40mil, drill to drill 11mil, minimum pad ring 10mil, minimum via ring 8mil, stop-mask expansion 4mil, vias tented up to drill 0mil, thermal gap 10mil

### Footprints (pad centres in the part's own frame; a part is rotated, then mirrored left to right if it is on the bottom)
T816108A1S102CEU = drill 1.02 pad 1.53 square: 1 5.1,0 | drill 1.02 pad 1.53: 2 5.1,2.54; 3 7.64,0; 4 7.64,2.54; 5 10.18,0; 6 10.18,2.54; 7 12.72,0; 8 12.72,2.54
KK-156-3 = drill 1.7 pad 2.184 long: 1 -3.96,0; 2 0,0; 3 3.96,0
C0805 = smd 1.3 x 1.5: 1 -0.95,0; 2 0.95,0
C1206 = smd 1.6 x 1.8: 1 -1.4,0; 2 1.4,0
C0805K = smd 1.3 x 1.6: 1 -1,0; 2 1,0
LD09P24A4GV00LF = drill 0.9 pad 1.4 square: 1 0,0 | drill 0.9 pad 1.4: 2 2.74,0; 3 5.48,0; 4 8.22,0; 5 10.96,0; 6 1.37,-2.84; 7 4.11,-2.84; 8 6.85,-2.84; 9 9.59,-2.84 | drill 3.2 pad 4.8: MH1 -7.015,-1.42; MH2 17.975,-1.42
SMB = smd 2.4 x 2.4: A 2.2,0; C -2.2,0
DIOM7959X262N = smd 2.2 x 3.15: 1 -3.5,0; 2 3.5,0
KK-156-6 = drill 1.7 pad 2.184 long: 1 -9.9,0; 2 -5.94,0; 3 -1.98,0; 4 1.98,0; 5 5.94,0; 6 9.9,0
01530008 = drill 1.27 pad 2: 1 1.727,3.81; 2 -1.727,-3.81 | hole 3.785: 0,0
KK-156-2 = drill 1.7 pad 2.184 long: 1 -1.98,0; 2 1.98,0
3,2 = hole 3.2: 0,0
SO16 = smd 0.66 x 2.032: 1 -4.445,-3.073; 2 -3.175,-3.073; 3 -1.905,-3.073; 4 -0.635,-3.073; 5 0.635,-3.073; 6 1.905,-3.073; 7 3.175,-3.073; 8 4.445,-3.073; 9 4.445,3.073; 10 3.175,3.073; 11 1.905,3.073; 12 0.635,3.073; 13 -0.635,3.073; 14 -1.905,3.073; 15 -3.175,3.073; 16 -4.445,3.073
SO08 = smd 0.6 x 2.2: 1 -1.905,-2.6; 2 -0.635,-2.6; 3 0.635,-2.6; 4 1.905,-2.6; 5 1.905,2.6; 6 0.635,2.6; 7 -0.635,2.6; 8 -1.905,2.6
SOIC8 = smd 0.6 x 2.2: 1 -1.905,-2.6; 2 -0.635,-2.6; 3 0.635,-2.6; 4 1.905,-2.6; 5 1.905,2.6; 6 0.635,2.6; 7 -0.635,2.6; 8 -1.905,2.6
SO14 = smd 0.66 x 2.032: 1 -3.81,-3.073; 2 -2.54,-3.073; 3 -1.27,-3.073; 4 0,-3.073; 5 1.27,-3.073; 6 2.54,-3.073; 7 3.81,-3.073; 8 3.81,3.073; 9 2.54,3.073; 10 1.27,3.073; 11 0,3.073; 12 -1.27,3.073; 13 -2.54,3.073; 14 -3.81,3.073
T9AS1D1248T9A = drill 1.17 pad 1.755: 1 0,0; 2 -10.16,0 | drill 2.06 pad 3.09: 3 -13.97,12.7 | drill 2.19 pad 3.3: 4 3.81,15.24
T9AS1D12 = drill 2.19 pad 3.29: 1 -8.89,12.7; 2 8.89,15.24; 3 8.89,22.86 | drill 1.17 pad 1.77: 4 -5.08,0; 5 5.08,0
SML0805 = smd 1.2 x 1.2: A 1.05,0; C -1.05,0
SOIC08 = smd 0.66 x 2.032: 1 -1.905,-3.073; 2 -0.635,-3.073; 3 0.635,-3.073; 4 1.905,-3.073; 5 1.905,3.073; 6 0.635,3.073; 7 -0.635,3.073; 8 -1.905,3.073
SOT23 = smd 0.9 x 1.2: 1 -0.95,-1.2; 2 0.95,-1.2; 3 0,1.2
R1206 = smd 1.6 x 1.803: 1 -1.422,0; 2 1.422,0
R0805 = smd 1.3 x 1.5: 1 -0.95,0; 2 0.95,0
P1-17 = drill 1.702 pad 2.54 octagon: TP 0,0
TP11R = smd 1.1 x 1.1: TP 0,0

### Placement (x,y rotation side)
BMS_I/O  96.52,95.25 0 top
BMS_POWER/GND  140.97,58.42 90 top
C1  114.3,17.78 0 top
C2  114.3,15.24 0 top
C3  114.3,12.7 0 top
C4  48.26,22.86 90 top
C5  34.29,20.32 90 top
C6  68.2,78.99 270 bottom
C7  67.69,82.04 270 top
C8  76.45,87.63 270 top
C9  59.69,90.81 0 top
CAN1  156.21,46.99 90 top
CAN2  135.89,25.4 90 top
D1  99.06,69.85 180 top
D2  118.11,67.31 90 top
D3  57.15,13.97 90 top
D5  125.73,67.31 90 top
D7  34.29,73.66 0 top
D8  74.93,73.66 0 top
EMSDC  72.39,97.79 180 top
F1  123.19,77.47 270 top
F2  121.92,86.36 90 top
FAN  41.91,8.89 90 top
H1  6.35,97.79 90 top
H2  6.68,6.6 0 top
H3  160.48,99.28 0 top
H4  160.3,5.04 90 top
IC1  50.93,77.85 270 bottom
IC2  73.66,82.55 270 bottom
IC4  41.91,21.59 90 top
IC9  59.69,85.09 90 bottom
ISOMETER_I/O  121.92,5.08 0 top
K1  67.31,60.96 180 top
K2  102.87,59.69 180 top
K3  68.58,13.97 270 top
K4  35.56,59.69 180 top
LED1  93.98,74.93 0 top
LED2  54.61,25.15 270 top
LED3  30.48,22.86 270 top
LED4  48.13,88.77 270 top
LED5  50.8,88.77 270 top
LED6  45.72,88.77 270 top
LED7  35.56,77.47 180 top
LED8  74.3,78.74 180 top
MISC_I/O  7.62,43.18 90 top
OK2  39.37,87.63 270 bottom
POWER/GND  140.97,74.93 90 top
PRECHARGE/AIRS  153.67,91.44 141.3 top
Q1  40.64,78.74 180 top
Q2  74.3,77.72 90 bottom
Q3  50.8,77.47 180 top
Q4  40.64,73.66 90 top
R1  123.19,33.02 90 top
R2  59.69,88.9 180 top
R3  39.37,84.84 180 top
R4  125.73,33.02 90 top
R5  65.41,82.42 270 top
R6  50.8,85.09 90 top
R7  48.26,85.09 90 top
R8  45.72,85.09 90 top
R9  82.55,77.47 90 top
R10  72.39,86.36 180 top
R11  78.74,87.63 90 top
R12  40.64,82.55 0 top
R14  31.75,77.47 180 top
R15  71.12,77.47 270 top
R19  40.89,70.61 0 top
R20  98.81,73.91 90 top
R21  52.07,22.86 90 top
R22  30.48,17.78 90 top
R24  78.74,77.47 270 bottom
R25  50.8,81.28 0 top
THERAL_EX_I/O  22.86,95.25 226.4 top
TP1  41.53,93.47 0 top
TP2  53.72,93.34 0 top
TP3  49.53,93.47 0 top
TP4  83.82,81.28 0 top
TP5  59.05,78.11 0 top
TP6  59.56,72.14 0 top
TP7  45.72,93.47 0 top
TP8  26.67,87.63 0 top
TP9  26.67,86.36 0 top
TP10  37.59,93.47 0 top
TP11  67.18,88.27 0 top
TP12  58.04,93.47 0 top
TP14  85.09,72.39 0 top
TP16  64.77,90.42 0 top
TP17  81.28,85.09 0 top
TP21  35.56,81.28 0 top
TP23  92.33,81.28 0 top
TP24  34.29,25.4 0 top
WIFI_I/O  24.13,12.7 134.2 top

### Tracks (layer width: path | path; a pad name or v marks a point on that pad's centre or on a via)
+3V3  (via drill 0.55)
  Top 0.508: IC4.2 44.51,20.32 | 44.51,20.32 IC4.1 | C4.1 48.26,20.32 | 48.26,20.32 52.07,20.32 R21.1 | 44.51,20.32 48.26,20.32 | R5.2 64.96,81.47 v61.84,78.36 | R7.1 R6.1 51.45,84.79 51.8,84.79 52.7,85.7 v52.7,86.36 | v43.18,83.82 43.5,84.14 R8.1 | R10.2 71.44,87.19 v72.39,88.14
  Top 0.889: C1.1 C2.1 | C3.1 C2.1 | C2.1 v110.49,15.24
  Top 1.27: 48.26,20.32 49.53,19.05 v52.07,19.05
  Route15 0.508: v61.47,70.99 62.36,70.99 62.36,76.2 63.5,77.34 63.5,82.55 | v61.84,78.36 61.84,80.89 62.23,81.28 | v43.18,83.82 46.99,87.63 50.8,87.63 | v78.11,80.77 78.11,81.92 76.2,83.82
  Route15 1.27: v52.07,19.05 58.42,19.05 68.58,8.89
  Bottom 0.508: IC1.5 53.47,76.68 52.82,76.68 52.58,76.44 52.58,72.91 55.16,70.33 60.8,70.33 v61.47,70.99 | IC1.16 44.7,82.3 v43.18,83.82 | IC9.14 63.3,81.81 64.95,81.81 67.56,84.43 69.2,84.43 69.23,84.45 IC2.8 71.06,86.81 v72.39,88.14 | OK2.8 34.39,91.44 v34.29,91.44 | IC2.4 77.98,80.64 v78.11,80.77
  pour Route15 (rank 2): 0,104.14 165.1,104.14 167.64,101.6 167.64,0 1.27,0 0,-1.27
+12V  (via drill 0.55, 0.9)
  Top 0.889: R22.1 30.8,16.51 34.29,16.51 | 34.29,16.51 C5.1 | 34.29,16.51 v35.56,16.51 | IC4.8 38.73,19.68 v36.83,17.78 | D3.C 53.89,11.77 v53.85,11.81 | R14.2 29.21,77.47 29.21,73.66 | 29.21,73.66 D7.C | 29.21,73.66 v27.3,73.66 | D8.C 71.12,75.27 | 71.12,75.27 R15.2 | 71.12,75.27 69.85,74 v69.85,73.66 | D5.1 D2.1 116.01,65.91 v113.28,65.91 | R20.1 101.26,70.51 D1.C v106.68,69.85
  pour Route15: 59.69,5.08 38.1,5.08 2.54,40.64 2.54,54.61 15.24,67.31 15.24,76.2 29.21,90.17 45.72,90.17 58.42,77.47 59.69,77.47 64.77,82.55 81.28,82.55 86.36,77.47 101.6,77.47 104.14,80.01 111.76,80.01 119.38,72.39 127,72.39 135.89,63.5 144.78,63.5 144.78,33.02 148.59,29.21 148.59,6.35 146.05,3.81 125.73,3.81 121.92,7.62 121.92,21.59 80.01,21.59 78.74,20.32 74.93,20.32
AMS_LED-  (via drill 0.55)
  Top 0.508: MISC_I/O.5 13.95,59.69 v16.51,59.69 | v38.48,75.69 40.33,77.54 Q1.3
  Bottom 0.508: v16.51,59.69 22.9,66.08 23.85,66.08 33.46,75.69 v38.48,75.69
CAN1_H
  Top 0.508: BMS_I/O.1 101.6,95.25
  Top 0.889: CAN1.3 151.13,57.55 151.13,73.66 133.48,91.31 105.54,91.31 101.6,95.25
  Bottom 0.508: MISC_I/O.4 5.96,50.82 7.13,51.99 70.91,51.99 89.15,70.23 89.15,84.84 99.57,95.25 BMS_I/O.1
CAN1_L
  Top 0.889: CAN1.5 152.4,61.76 152.4,74.93 134.62,92.71 106.68,92.71 104.16,95.23 BMS_I/O.3
  Bottom 0.508: MISC_I/O.6 5.08,52.48 3.91,51.3 3.91,50.34 4.59,49.65 8.11,49.65 9.26,50.8 71.12,50.8 90.17,69.85 90.17,83.82 100.33,93.98 102.89,93.98 BMS_I/O.3
CAN2_H  (via drill 0.55, 0.55 layers 1-2)
  Top 0.508: WIFI_I/O.3 16.83,18.18 15.7,17.05 8.35,17.05 1.27,24.13 1.27,57.15 2.54,58.42 6.35,58.42 7.62,57.15 MISC_I/O.7
  Top 0.889: CAN2.3 133.75,33.02 127.15,33.02 R4.1 R1.1 114.15,31.6 v113.03,30.48 | WIFI_I/O.3 29.84,29.21 v33.02,29.21
  Route2 0.508: THERAL_EX_I/O.3 17.59,94.81 24.29,101.5 103.62,101.5 106.7,98.42 BMS_I/O.6
  Route2 0.889: v33.02,29.21 34.29,30.48 v113.03,30.48
  Bottom 0.508: MISC_I/O.7 7.62,77.85 17.59,87.82 THERAL_EX_I/O.3
CAN2_L  (via drill 0.55, 0.55 layers 1-2)
  Top 0.508: WIFI_I/O.5 16.44,19.41 14.72,19.41 13.35,18.03 8.89,18.03 2.29,24.64 2.29,54.36 3.83,55.9 MISC_I/O.8
  Top 0.889: CAN2.5 133.82,34.29 125.88,34.29 R4.2 R1.2 119.53,34.44 v118.11,33.02 | WIFI_I/O.5 28.79,31.75 v30.48,31.75
  Route2 0.508: THERAL_EX_I/O.5 15.84,94.58 23.75,102.49 105.18,102.49 109.24,98.42 BMS_I/O.8
  Route2 0.889: v30.48,31.75 31.75,33.02 v118.11,33.02
  Bottom 0.508: MISC_I/O.8 6.6,57.42 6.6,78.36 12.7,84.45 12.7,87.63 12.95,87.88 THERAL_EX_I/O.5
CHARGE_POWER  (via drill 0.55, 0.9)
  Top 0.889: F1.1 125.73,74.47 D5.2 128.58,70.81 BMS_POWER/GND.2 | v22.86,40.64 v22.86,68.58
  Route2 0.889: v93.22,70.36 96.52,73.66 125.73,73.66 127,74.93 F1.1
  Route15 0.889: v22.86,68.58 39.12,68.58 40.2,69.66 51.25,69.66 52.9,68.01 90.87,68.01 v93.22,70.36
  Bottom 0.889: WIFI_I/O.2 22.2,14.59 22.86,15.24 v22.86,40.64 | v22.86,68.58 22.86,88.13 THERAL_EX_I/O.2
CHARGE_SAFE  (via drill 0.35, 0.55)
  Top 0.508: v59.69,83.82 56.8,83.82 LED5.C 49.53,91.09 TP3.TP
  Route2 0.508: v66.04,85.09 66.14,85.19 69.02,85.19 70.01,86.17 70.01,87.56 69.9,87.68 74.93,92.71 90.17,92.71 95.25,97.79 BMS_I/O.2
  Bottom 0.508: v59.69,83.82 IC9.12 63.25,84.31 65.09,84.31 65.88,85.09 v66.04,85.09
CHASSIS_GND
  Bottom 1.27: ISOMETER_I/O.3 129.56,3.81 128.29,2.54 115.57,2.54 80.01,38.1 27.94,38.1 17.76,48.28 MISC_I/O.1
DISCHARGE_ENABLE  (via drill 0.35)
  Top 0.508: v58.93,86.23 60.96,84.2 v60.96,82.55 | v44.45,76.2 44.45,77.47 41.98,79.94 Q1.1 R12.2 46.99,82.55 46.99,88.68 LED4.C 48.13,91.57 46.23,93.47 TP7.TP | TP6.TP 53.09,72.14 v52.07,71.12
  Route15 0.508: TP6.TP 60.96,73.53 v60.96,82.55
  Bottom 0.508: IC9.6 IC9.5 58.8,86.36 v58.93,86.23 | v60.96,82.55 IC9.13 63.3,83.08 65.28,83.08 67.29,85.09 68.93,85.09 70.01,86.17 70.01,87.56 69.9,87.68 74.93,92.71 90.17,92.71 97.28,99.82 102.13,99.82 BMS_I/O.4 | v44.45,76.2 44.45,74.93 45.72,73.66 47.6,73.66 IC1.9 50.14,71.12 v52.07,71.12
FAN+
  Top 0.889: K3.4 80.57,6.91 FAN.1
FAN_ENABLE  (via drill 0.55)
  Top 0.508: D3.A 65.11,24.13 K3.2
  Top 0.889: v91.44,48.26 68.58,25.4 K3.2
  Bottom 0.889: BMS_I/O.5 101.6,90.15 101.6,57.15 92.71,48.26 v91.44,48.26
GND  (via drill 0.55, 0.75, 0.9 pad 1.3)
  Top 0.889: R9.1 81.59,76.52 v80.64,77.47 | R12.1 37.4,84.84 | 37.4,84.84 36.52,85.72 v34.42,85.72 | R3.2 37.4,84.84 | Q1.2 38.28,79.94 v38.23,79.88 | C1.2 C2.2 C3.2 122.87,5.08 ISOMETER_I/O.1 | FAN.2 41.91,11.43 v39.37,13.97 | IC4.6 IC4.7 | IC4.3 IC4.6 | IC4.6 37.47,22.23 | 37.47,22.23 v36.83,22.86 | C5.2 35.24,22.23 | 35.24,22.23 37.47,22.23 | 35.24,22.23 35.24,24.45 TP24.TP | LED3.C 28.61,23.91 v28.57,23.88 | C4.2 48.26,24.13 v50.33,26.2 LED2.C | C8.2 R11.1 v78.74,83.82 | C9.2 61.33,91.44 v62.23,91.44 | C7.2 67.06,80.01 65.41,80.01 v64.77,79.38 | Q3.2 R25.1 v45.72,81.28 | Q4.2 43.12,74.61 v43.43,74.3 | R19.1 39.94,69.28 v40.64,68.58
  Bottom 0.889: v80.64,77.47 80.64,77.98 80.2,78.42 R24.1 | IC1.11 47.85,76.2 | 47.85,76.2 IC1.12 | IC1.14 IC1.15 45.97,81.03 | OK2.5 v34.42,85.72 | IC2.1 78.11,84.45 v78.74,83.82 | IC9.7 56.62,90.65 v56.64,90.68 | Q2.2 68.83,78.67 C6.2 66.1,78.04 v64.77,79.38 | v45.72,81.28 45.97,81.03 | 47.85,76.2 45.97,78.08 45.97,81.03 | IC1.8 54.25,73.66 v55.88,73.66
  pour Route2: 0,104.14 167.64,104.14 167.64,-1.27 0,-1.27
HIGHEST_TEMP
  Top 0.508: THERAL_EX_I/O.4 26.33,87.97 TP8.TP
IMD_COIL_OUT  (via drill 0.35)
  Top 0.508: v76.71,78.87 76.2,78.87 | 76.2,78.87 75.47,78.87 LED8.C | 76.2,78.87 77.13,77.94 D8.A 78.4,72.39 TP14.TP
  Top 1.27: D8.A 77.13,61.3 K1.2
  Bottom 0.508: v76.71,78.87 76.71,78.23 76.2,77.72 Q2.3
IMD_LED-  (via drill 0.55)
  Top 0.508: MISC_I/O.3 15.22,58.42 v17.78,58.42 | v45.72,72.39 49.6,76.27 Q3.3
  Bottom 0.508: v17.78,58.42 25.4,66.04 44.45,66.04 45.72,67.31 v45.72,72.39
LOWEST_TEMP
  Top 0.508: THERAL_EX_I/O.6 26.44,86.13 TP9.TP
N$1  (via drill 0.35)
  Top 0.508: R2.1 61.91,87.63 63.75,87.63 64.39,87 | 64.39,87 v64.39,86.74 | TP16.TP 64.39,90.04 64.39,87
  Bottom 0.508: v64.39,86.74 64.01,86.36 IC9.10
N$2
  Top 0.889: F2.2 127.81,82.55 132.08,82.55 139.7,74.93 POWER/GND.2
N$3
  Route15 2.54: K2.2 96.52,41.91 115.57,41.91 139.7,66.04 146.05,66.04 161.4,81.39 PRECHARGE/AIRS.1
N$4
  Top 0.889: F1.2 121.46,81.28 130.66,81.28 POWER/GND.1
N$5  (via drill 0.35)
  Top 0.508: v38.1,87.63 39.37,88.9 v44.45,88.9 44.8,88.9 LED6.C 42.07,93.47 TP1.TP
  Bottom 0.508: OK2.6 37.47,87 v38.1,87.63 | IC1.4 53.75,78.74 50.8,78.74 49.53,80.01 49.53,86.36 46.99,88.9 v44.45,88.9
N$6  (via drill 0.35)
  Top 0.508: TP11.TP 67.18,87.5 v64.77,85.09
  Bottom 0.508: IC9.8 IC9.9 61.72,87.63 60.83,86.74 60.83,85.6 61.34,85.09 IC9.11 v64.77,85.09
N$7  (via drill 0.35)
  Top 0.508: v40.64,86.36 40.64,85.16 R3.1
  Bottom 0.508: OK2.3 41.27,87 v40.64,86.36
N$8  (via drill 0.35)
  Top 0.508: v78.74,79.6 81.28,82.14 TP17.TP
  Bottom 0.508: IC9.3 58.42,83.82 61.34,80.9 61.34,80.78 65.35,76.77 Q2.1 73.35,76.52 77.47,76.52 | 77.47,76.52 R24.2 | 77.47,76.52 77.47,78.33 77.58,78.44 77.58,79.24 77.82,79.48 78.62,79.48 v78.74,79.6
N$9  (via drill 0.35)
  Top 0.508: R25.2 51.75,79.88 | 51.75,79.88 Q3.1 | 51.75,79.88 v52.32,79.88 | TP5.TP 58.42,78.74 v58.42,80.01
  Bottom 0.508: v52.32,79.88 52.32,80.01 53.34,81.03 IC1.2 54.25,81.28 IC9.1 | IC9.2 IC9.1 | v58.42,80.01 57.89,80.01 IC9.1
N$10  (via drill 0.35)
  Top 0.508: v57.15,76.2 57.15,80.01 58.42,81.28 60.96,81.28 62.23,82.55 62.23,85.33 59.58,87.98 59.58,88.06 R2.2 58.69,88.95 C9.1 58.04,91.46 TP12.TP
  Bottom 0.508: IC1.6 56.9,75.95 v57.15,76.2
N$11
  Route2 2.54: K2.1 134.11,69.34 134.11,84.33 138.68,88.9 143.51,88.9 149.03,94.42 PRECHARGE/AIRS.5
  Route15 2.54: EMSDC.5 76.45,87.79 82.4,87.79 82.56,87.63 97.79,87.63 102.87,82.55 102.87,52.07 107.95,46.99 K2.1
N$12
  Bottom 2.54: PRECHARGE/AIRS.2 144.94,74.36 144.94,69.85 144.78,69.69 144.78,68.58 142.24,66.04 123.19,66.04 K2.3
N$13  (via drill 1 layers 1-2)
  Top 1.27: v86.36,90.17 82.55,93.98 82.55,97.79 EMSDC.1
  Route2 1.27: K4.3 58.85,46.99 62.51,43.33 64.49,43.33 79.14,57.97 79.14,71.52 86.36,78.74 v86.36,90.17
N$14  (via drill 1 layers 1-2)
  Top 1.27: v82.55,90.17 78.33,94.39 EMSDC.2
  Route2 1.27: K1.4 74.93,57.15 74.93,82.55 v82.55,90.17
N$15
  Top 0.889: Q4.3 D7.A 36.61,73.78 | 36.61,73.78 LED7.C 36.61,80.23 TP21.TP | 36.61,73.78 36.61,68.8 K4.2
N$16  (via drill 0.35)
  Top 0.508: R19.2 Q4.1 43.11,71.44 51.12,71.44 55.88,76.2 55.88,82.8 v53.59,85.09 | TP2.TP 54.61,92.46 v54.61,88.9
  Bottom 0.508: v53.59,85.09 54.61,85.09 | 54.61,85.09 IC9.4 | v54.61,88.9 54.61,85.09
N$17  (via drill 0.35)
  Top 0.508: R5.1 67.62,83.37 C7.1 69.09,83.44 v69.22,83.57
  Bottom 0.508: v69.22,83.57 70.68,83.57 IC2.7 IC2.6
N$18
  Top 0.508: LED7.A R14.1
N$19
  Bottom 2.54: EMSDC.3 EMSDC.4
N$20
  Top 0.508: R15.1 71.44,78.74 LED8.A
N$21
  Route15 2.54: K1.3 72.39,39.37 36.83,39.37 K4.4
N$22
  Top 0.508: R20.2 95.1,74.86 LED1.A
N$23
  Top 0.508: LED2.A 52.36,24.1 R21.2
N$24
  Top 0.508: LED3.A R22.2
N$25
  Top 0.508: R7.2 48.13,86.17 LED4.A
N$26
  Top 0.508: R6.2 LED5.A
N$27
  Top 0.508: R8.2 LED6.A
N$28  (via drill 0.35)
  Top 0.508: v73.66,83.82 73.34,84.14 R10.1 73.66,86.68 73.66,87.63 74.61,88.58 C8.1 R11.2
  Bottom 0.508: IC2.2 74.3,83.19 v73.66,83.82
N$32
  Bottom 0.508: C6.1 68.9,80.64 IC2.5
OK_HS  (via drill 0.35, 0.55)
  Top 0.508: v40.64,91.06 38.23,93.47 TP10.TP
  Top 0.889: v119.38,36.83 109.22,36.83 91.44,54.61 63.5,54.61 53.34,64.77 v53.34,69.09
  Route2 0.889: v53.34,69.09 53.34,76.58 40.64,89.28 v40.64,91.06
  Bottom 0.508: OK2.2 41.27,88.27 40.64,88.9 v40.64,91.06
  Bottom 0.889: ISOMETER_I/O.8 119.38,22.88 v119.38,36.83
PRECHARGE_SELECT  (via drill 0.55)
  Top 0.508: TP23.TP 92.33,75.53 LED1.C 92.93,73.78 D1.A 96.86,60.62 K2.5
  Top 0.889: v109.22,88.9 101.6,81.28 TP23.TP
  Bottom 0.889: BMS_I/O.7 109.24,88.92 v109.22,88.9
READY_POWER  (via drill 0.55, 0.9)
  Top 0.889: F2.1 116.84,86.82 116.84,74.93 118.11,73.66 D2.2 120.34,68.58 127,68.58 137.16,58.42 137.16,55.88 138.58,54.46 BMS_POWER/GND.1 | v20.57,40.51 21.08,41.02 v21.08,65.91
  Route2 0.889: v90.3,65.91 90.3,66.17 91.44,67.31 91.44,71.12 95.25,74.93 111.76,74.93 118.11,81.28 F2.1
  Route15 0.889: v21.08,65.91 v90.3,65.91
  Bottom 0.889: WIFI_I/O.1 v20.57,40.51 | v20.57,40.51 | v21.08,65.91 22.1,66.93 23.5,66.93 24.13,67.57 24.13,69.11 24.13,88.9 21.47,91.56 THERAL_EX_I/O.1
STARTUP_RESET  (via drill 0.35)
  Top 0.508: R9.2 82.55,78.74 v81.28,80.01 82.55,80.01 TP4.TP | v63.75,75.18 67.31,78.74 69.39,78.74 v72.69,82.04
  Bottom 0.508: v81.28,80.01 79.38,81.92 IC2.3 76.13,82.04 v72.69,82.04 | IC1.7 58.42,74.68 | 58.42,74.68 63.25,74.68 v63.75,75.18 | 58.42,74.68 58.42,76.2 54.86,79.76 IC1.3